# Altium project RSX_High_Power_Board.PrjPcb (part 1 of 2)
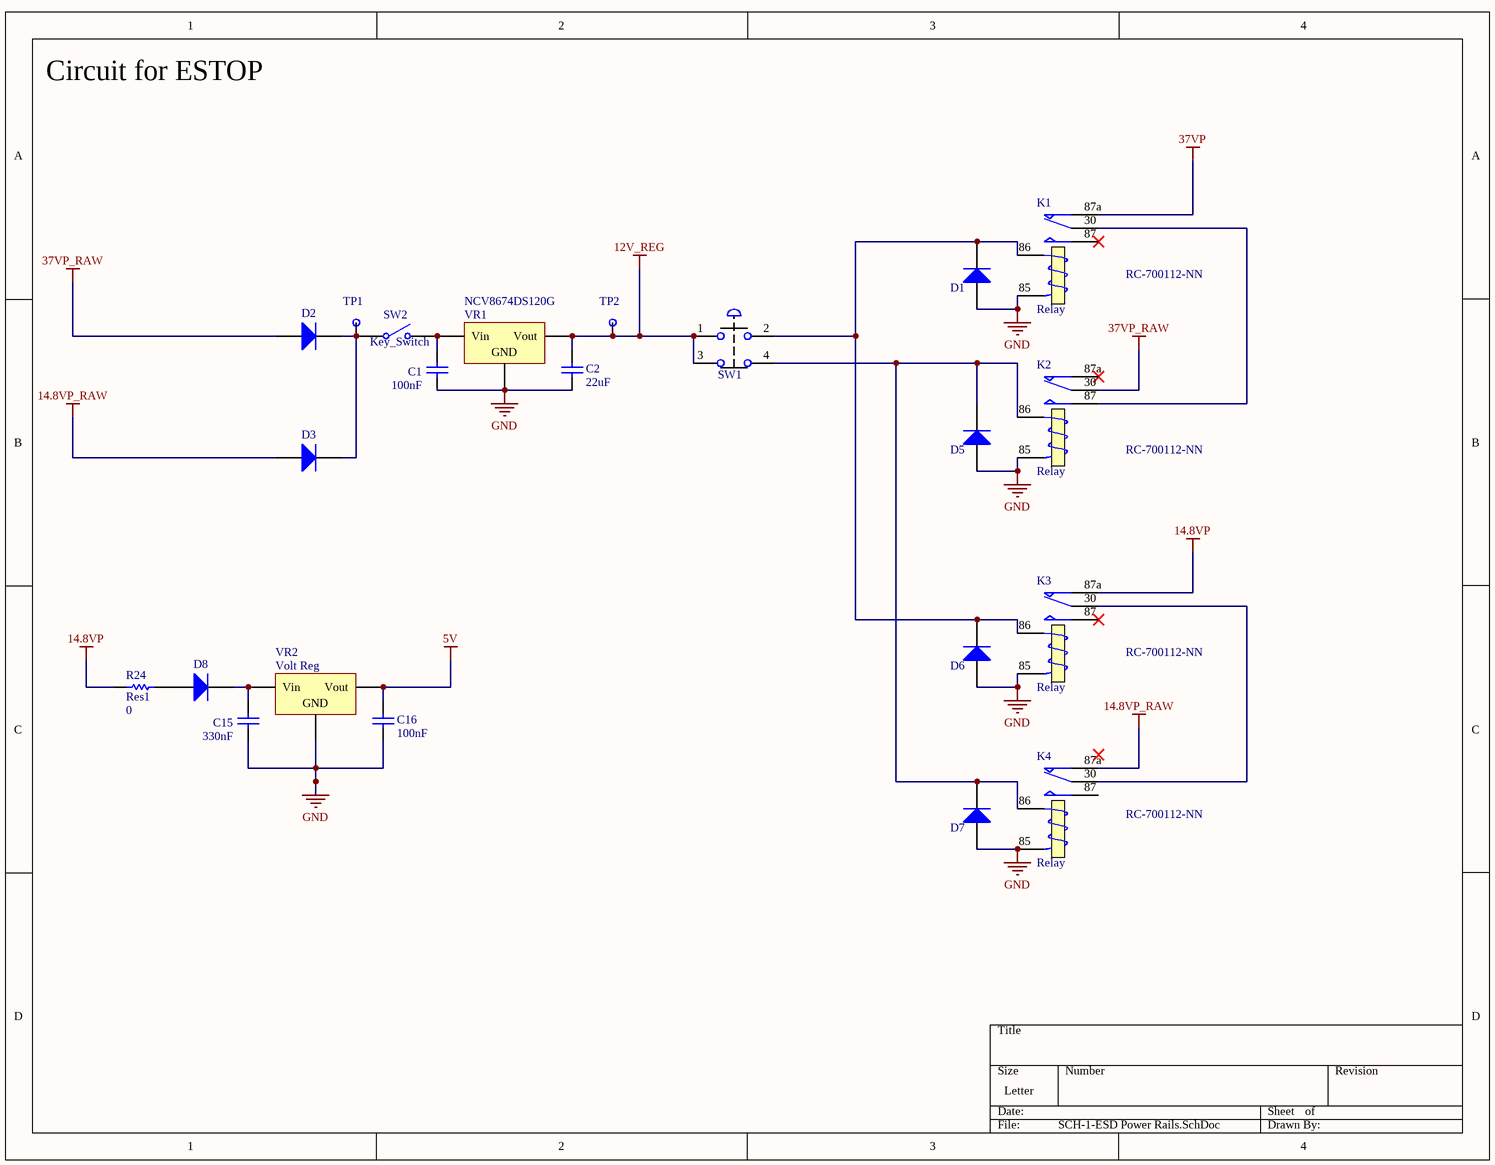
[diagram p0: SCH-1-ESD Power Rails.SchDoc]
11 sheets, 231 parts. Net scope: flat (ports and power ports of the same name join across sheets).
Board file: Drive Board.PcbDoc
Sheets:
  SCH-1-ESD Power Rails.SchDoc
  SCH-2-Main Controls.SchDoc
  SCH-3-ESC1.SchDoc
  SCH-4-ESC2.SchDoc
  SCH-5-ESC3.SchDoc
  SCH-6-ESC4.SchDoc
  SCH-7-ESC5.SchDoc
  SCH-8-ESC6.SchDoc
  SCH-9-Battery Voltage Indicators.SchDoc
  SCH-10-Power Connectors.SchDoc
  SCH-11-Out Going Connectors.SchDoc

## Sheet SCH-1-ESD Power Rails.SchDoc
size Letter

### Parts
C1  value 100nF  [1608[0603]]  (hidden comment: Cap)
C2  value 22uF  [1608[0603]]  (hidden comment: Cap)
C15  value 330nF  [1608[0603]]  (hidden comment: Cap)
C16  value 100nF  [1608[0603]]  (hidden comment: Cap)
D1  Diode 1N4001  [DO-41]  (value not drawn)
D2  Diode 1N4001  [DO-41]  (value not drawn)
D3  Diode 1N4001  [DO-41]  (value not drawn)
D5  Diode 1N4001  [DO-41]  (value not drawn)
D6  Diode 1N4001  [DO-41]  (value not drawn)
D7  Diode 1N4001  [DO-41]  (value not drawn)
D8  Diode 1N4001  [DO-41]  (value not drawn)
K1  Relay  [Relay RC-700112-NN]
K2  Relay  [Relay RC-700112-NN]
K3  Relay  [Relay RC-700112-NN]
K4  Relay  [Relay RC-700112-NN]
R24  Res1  value 0  [AXIAL-0.3]
SW1  NO-NC ESD with light  [MOLEX 0039281043]  (value not drawn)
SW2  Key_Switch  [MOLEX_0039293026]
TP1  TestPt  [50_MIL_PAD]  (value not drawn)
TP2  TestPt  [50_MIL_PAD]  (value not drawn)
VR1  Volt Reg  [DPAK254P1420X457-3N]  (value not drawn)
VR2  Volt Reg  [D2PAK_N]

### Nets
5V: C16.1 VR2.3(Vout)
12V_REG: C2.1 SW1.1 SW1.3 TP2.1 VR1.3(Vout)
14.8VP: K3.87a(NC) R24.1
14.8VP_RAW: D3.1(A) K4.87a(NC)
37VP: K1.87a(NC)
37VP_RAW: D2.1(A) K2.30(COM)
GND: C1.2 C2.2 C15.2 C16.2 D1.1(A) D5.1(A) D6.1(A) D7.1(A) K1.85(T2) K2.85(T2) K3.85(T2) K4.85(T2) VR1.2(GND) VR2.2(GND)
NetC1_1: C1.1 SW2.2(NO) VR1.1(Vin)
NetC15_1: C15.1 D8.2(K) VR2.1(Vin)
NetD1_2: D1.2(K) D6.2(K) K1.86(T1) K3.86(T1) SW1.2
NetD2_2: D2.2(K) D3.2(K) SW2.1(COMMON) TP1.1
NetD5_2: D5.2(K) D7.2(K) K2.86(T1) K4.86(T1) SW1.4
NetD8_1: D8.1(A) R24.2
NetK1_30: K1.30(COM) K2.87(NO)
NetK3_30: K3.30(COM) K4.30(COM)

Not connected (* = marked no-connect by the designer): K1 87(NO)*; K2 87a(NC)*; K3 87(NO)*; K4 87(NO)

### Notes on the sheet
- Circuit for ESTOP
- (near VR1) NCV8674DS120G
- RC-700112-NN

### Library data of the parts
C1 C2 C15 C16 = Cap: Capacitor; Published: 8-Jun-2000; LatestRevisionDate: 17-Jul-2002; LatestRevisionNote: Re-released for DXP Platform.; PackageReference: RAD-0.3; Publisher: Altium Limited; PackageDescription: Radial Cap, Thru-Hole; 2 Leads; 0.3 in Pin Spacing
D1-D3 D5-D8 = Diode 1N4001: 1 Amp General Purpose Rectifier; Published: 8-Jun-2000; LatestRevisionDate: 17-Jul-2002; LatestRevisionNote: Re-released for DXP Platform.; DatasheetVersion: 1998; PackageVersion: Aug-1999; PackageReference: DO-41; Publisher: Altium Limited; PackageDescription: Diode, Axial; Body 5.2 x 2.7 mm (LxDia. max), Lead Dia. 0.86 mm (max); Code_JEDEC: DO-204-AL; ComponentLink1Description: Manufacturer Link; ComponentLink1URL: http://www.fairchildsemi.com/; ComponentLink2Description: Datasheet; ComponentLink2URL: http://www.fairchildsemi.com/ds/1N%2F1N4001.pdf
K1-K4 = Relay: SPDT Relay; Published: 8-Jun-2000; LatestRevisionDate: 17-Jul-2002; LatestRevisionNote: Re-released for DXP Platform.; PackageReference: MODULE5B; Publisher: Altium Limited
R24 = Res1: Resistor; Published: 8-Jun-2000; LatestRevisionDate: 17-Jul-2002; LatestRevisionNote: Re-released for DXP Platform.; PackageReference: AXIAL-0.3; Publisher: Altium Limited; PackageDescription: Axial Device, Thru-Hole; 2 Leads; 0.3 in Pin Spacing
SW1 = DPST ESTOP
VR1 VR2 = Volt Reg: Voltage Regulator; Published: 24-Mar-1999; LatestRevisionDate: 29-May-2009; LatestRevisionNote: IPC-7351 Footprint Added.; PackageReference: D2PAK; Publisher: Altium Limited; PackageDescription: 3-Pin Transistor Outline Package 2.54 mm Pitch, 15.1 mm Lead Span
SW2 = Key_Switch: Published: 24-Mar-1999; LatestRevisionDate: 17-Jul-2002; LatestRevisionNote: Re-released for DXP Platform.; PackageReference: SPST-2; Publisher: Altium Limited; PackageDescription: Switch; 2 Leads

## Sheet SCH-2-Main Controls.SchDoc
size Letter
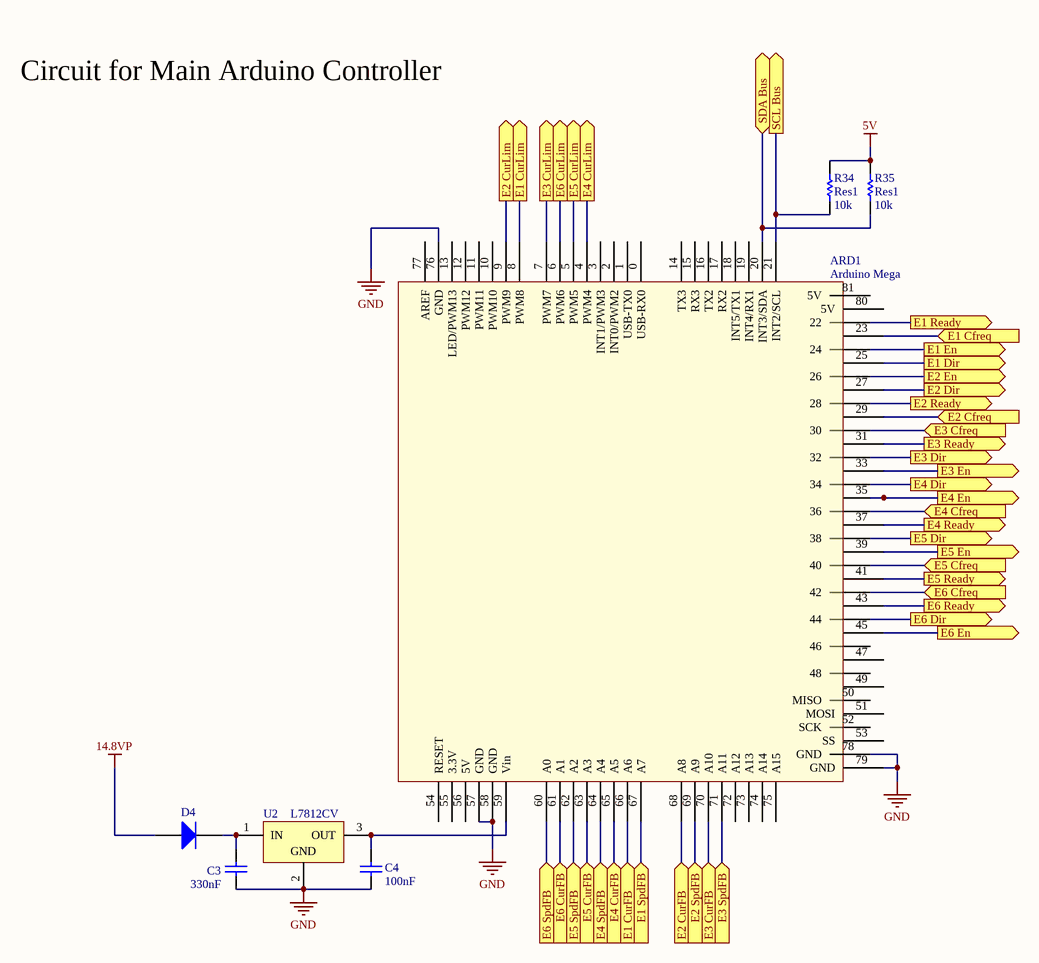
[diagram p1: SCH-2-Main Controls.SchDoc]

### Parts
ARD1  Arduino Mega  [Arduino Mega]
C3  value 330nF  [1608[0603]]  (hidden comment: Cap)
C4  value 100nF  [1608[0603]]  (hidden comment: Cap)
D4  Diode 1N4001  [DO-41]  (value not drawn)
R34  Res1  value 10k  [RESC1608X06N_0603]
R35  Res1  value 10k  [RESC1608X06N_0603]
U2  L7812CV  [TO220]

### Ports
E1 Cfreq (in), E1 CurFB (in), E1 CurLim (out), E1 Dir (out), E1 En (out), E1 Ready (out), E1 SpdFB (in), E2 Cfreq (in), E2 CurFB (in), E2 CurLim (out), E2 Dir (out), E2 En (out), E2 Ready (out), E2 SpdFB (in), E3 Cfreq (in), E3 CurFB (in), E3 CurLim (out), E3 Dir (out), E3 En (out), E3 Ready (out), E3 SpdFB (in), E4 Cfreq (in), E4 CurFB (in), E4 CurLim (out), E4 Dir (out), E4 En (out), E4 Ready (out), E4 SpdFB (in), E5 Cfreq (in), E5 CurFB (in), E5 CurLim (out), E5 Dir (out), E5 En (out), E5 Ready (out), E5 SpdFB (in), E6 Cfreq (in), E6 CurFB (in), E6 CurLim (out), E6 Dir (out), E6 En (out), E6 Ready (out), E6 SpdFB (in), SCL Bus (out), SDA Bus (bidir)

### Nets
5V: R34.2 R35.2
14.8VP: D4.1(A)
GND: ARD1.57(GND) ARD1.58(GND) ARD1.76(GND) ARD1.78(GND) ARD1.79(GND) C3.2 C4.2 U2.2(GND)
NetARD1_4: ARD1.4(PWM4) ; port E4 CurLim
NetARD1_5: ARD1.5(PWM5) ; port E5 CurLim
NetARD1_6: ARD1.6(PWM6) ; port E6 CurLim
NetARD1_7: ARD1.7(PWM7) ; port E3 CurLim
NetARD1_8: ARD1.8(PWM8) ; port E1 CurLim
NetARD1_9: ARD1.9(PWM9) ; port E2 CurLim
NetARD1_20: ARD1.20(INT3/SDA) R35.1 ; port SDA Bus
NetARD1_21: ARD1.21(INT2/SCL) R34.1 ; port SCL Bus
NetARD1_22: ARD1.22 ; port E1 Ready
NetARD1_23: ARD1.23 ; port E1 Cfreq
NetARD1_24: ARD1.24 ; port E1 En
NetARD1_25: ARD1.25 ; port E1 Dir
NetARD1_26: ARD1.26 ; port E2 En
NetARD1_27: ARD1.27 ; port E2 Dir
NetARD1_28: ARD1.28 ; port E2 Ready
NetARD1_29: ARD1.29 ; port E2 Cfreq
NetARD1_30: ARD1.30 ; port E3 Cfreq
NetARD1_31: ARD1.31 ; port E3 Ready
NetARD1_32: ARD1.32 ; port E3 Dir
NetARD1_33: ARD1.33 ; port E3 En
NetARD1_34: ARD1.34 ; port E4 Dir
NetARD1_35: ARD1.35 ; port E4 En
NetARD1_36: ARD1.36 ; port E4 Cfreq
NetARD1_37: ARD1.37 ; port E4 Ready
NetARD1_38: ARD1.38 ; port E5 Dir
NetARD1_39: ARD1.39 ; port E5 En
NetARD1_40: ARD1.40 ; port E5 Cfreq
NetARD1_41: ARD1.41 ; port E5 Ready
NetARD1_42: ARD1.42 ; port E6 Cfreq
NetARD1_43: ARD1.43 ; port E6 Ready
NetARD1_44: ARD1.44 ; port E6 Dir
NetARD1_45: ARD1.45 ; port E6 En
NetARD1_59: ARD1.59(Vin) C4.1 U2.3(OUT)
NetARD1_60: ARD1.60(A0) ; port E6 SpdFB
NetARD1_61: ARD1.61(A1) ; port E6 CurFB
NetARD1_62: ARD1.62(A2) ; port E5 SpdFB
NetARD1_63: ARD1.63(A3) ; port E5 CurFB
NetARD1_64: ARD1.64(A4) ; port E4 SpdFB
NetARD1_65: ARD1.65(A5) ; port E4 CurFB
NetARD1_66: ARD1.66(A6) ; port E1 CurFB
NetARD1_67: ARD1.67(A7) ; port E1 SpdFB
NetARD1_68: ARD1.68(A8) ; port E2 CurFB
NetARD1_69: ARD1.69(A9) ; port E2 SpdFB
NetARD1_70: ARD1.70(A10) ; port E3 CurFB
NetARD1_71: ARD1.71(A11) ; port E3 SpdFB
NetC3_1: C3.1 D4.2(K) U2.1(IN)

Not connected (* = marked no-connect by the designer): ARD1 0(USB-RX0) 1(USB-TX0) 2(INT0/PWM2) 3(INT1/PWM3) 10(PWM10) 11(PWM11) 12(PWM12) 13(LED/PWM13) 14(TX3) 15(RX3) 16(TX2) 17(RX2) 18(INT5/TX1) 19(INT4/RX1) 46 47 48 49 50(MISO) 51(MOSI) 52(SCK) 53(SS) 54(RESET) 55(3.3V) 56(5V) 72(A12) 73(A13) 74(A14) 75(A15) 77(AREF) 80(5V) 81(5V)

### Notes on the sheet
- Circuit for Main Arduino Controller

### Library data of the parts
C3 C4 = Cap: Capacitor; Published: 8-Jun-2000; LatestRevisionDate: 17-Jul-2002; LatestRevisionNote: Re-released for DXP Platform.; PackageReference: RAD-0.3; Publisher: Altium Limited; PackageDescription: Radial Cap, Thru-Hole; 2 Leads; 0.3 in Pin Spacing
D4 = Diode 1N4001: 1 Amp General Purpose Rectifier; Published: 8-Jun-2000; LatestRevisionDate: 17-Jul-2002; LatestRevisionNote: Re-released for DXP Platform.; DatasheetVersion: 1998; PackageVersion: Aug-1999; PackageReference: DO-41; Publisher: Altium Limited; PackageDescription: Diode, Axial; Body 5.2 x 2.7 mm (LxDia. max), Lead Dia. 0.86 mm (max); Code_JEDEC: DO-204-AL; ComponentLink1Description: Manufacturer Link; ComponentLink1URL: http://www.fairchildsemi.com/; ComponentLink2Description: Datasheet; ComponentLink2URL: http://www.fairchildsemi.com/ds/1N%2F1N4001.pdf
R34 R35 = Res1: Resistor; Published: 8-Jun-2000; LatestRevisionDate: 17-Jul-2002; LatestRevisionNote: Re-released for DXP Platform.; PackageReference: AXIAL-0.3; Publisher: Altium Limited; PackageDescription: Axial Device, Thru-Hole; 2 Leads; 0.3 in Pin Spacing
U2 = CMP-0244-00450-1: Positive Voltage Regulator, 12V, 3-Pin TO-220; PackageDescription: TO, Thru-Hole, Vertical, Heatsink Mounted; 3 In-Line Leads; Pitch 2.54 mm; ComponentLink3URL: http://www.st.com/internet/com/TECHNICAL_RESOURCES/TECHNICAL_LITERATURE/PACKAGE_INFORMATION/CD00004649.pdf; ComponentLink1URL: http://www.st.com; ComponentLink2Description: Datasheet; ComponentLink3Description: Package Specification; ComponentLink2URL: http://www.st.com/internet/com/TECHNICAL_RESOURCES/TECHNICAL_LITERATURE/DATASHEET/CD00000444.pdf; DatasheetVersion: 16/11/2011; PackageVersion: ver3.0; PackageReference: TO220; ComponentLink1Description: Manufacturer URL

## Sheet SCH-3-ESC1.SchDoc
size Letter; SheetNumber: 2
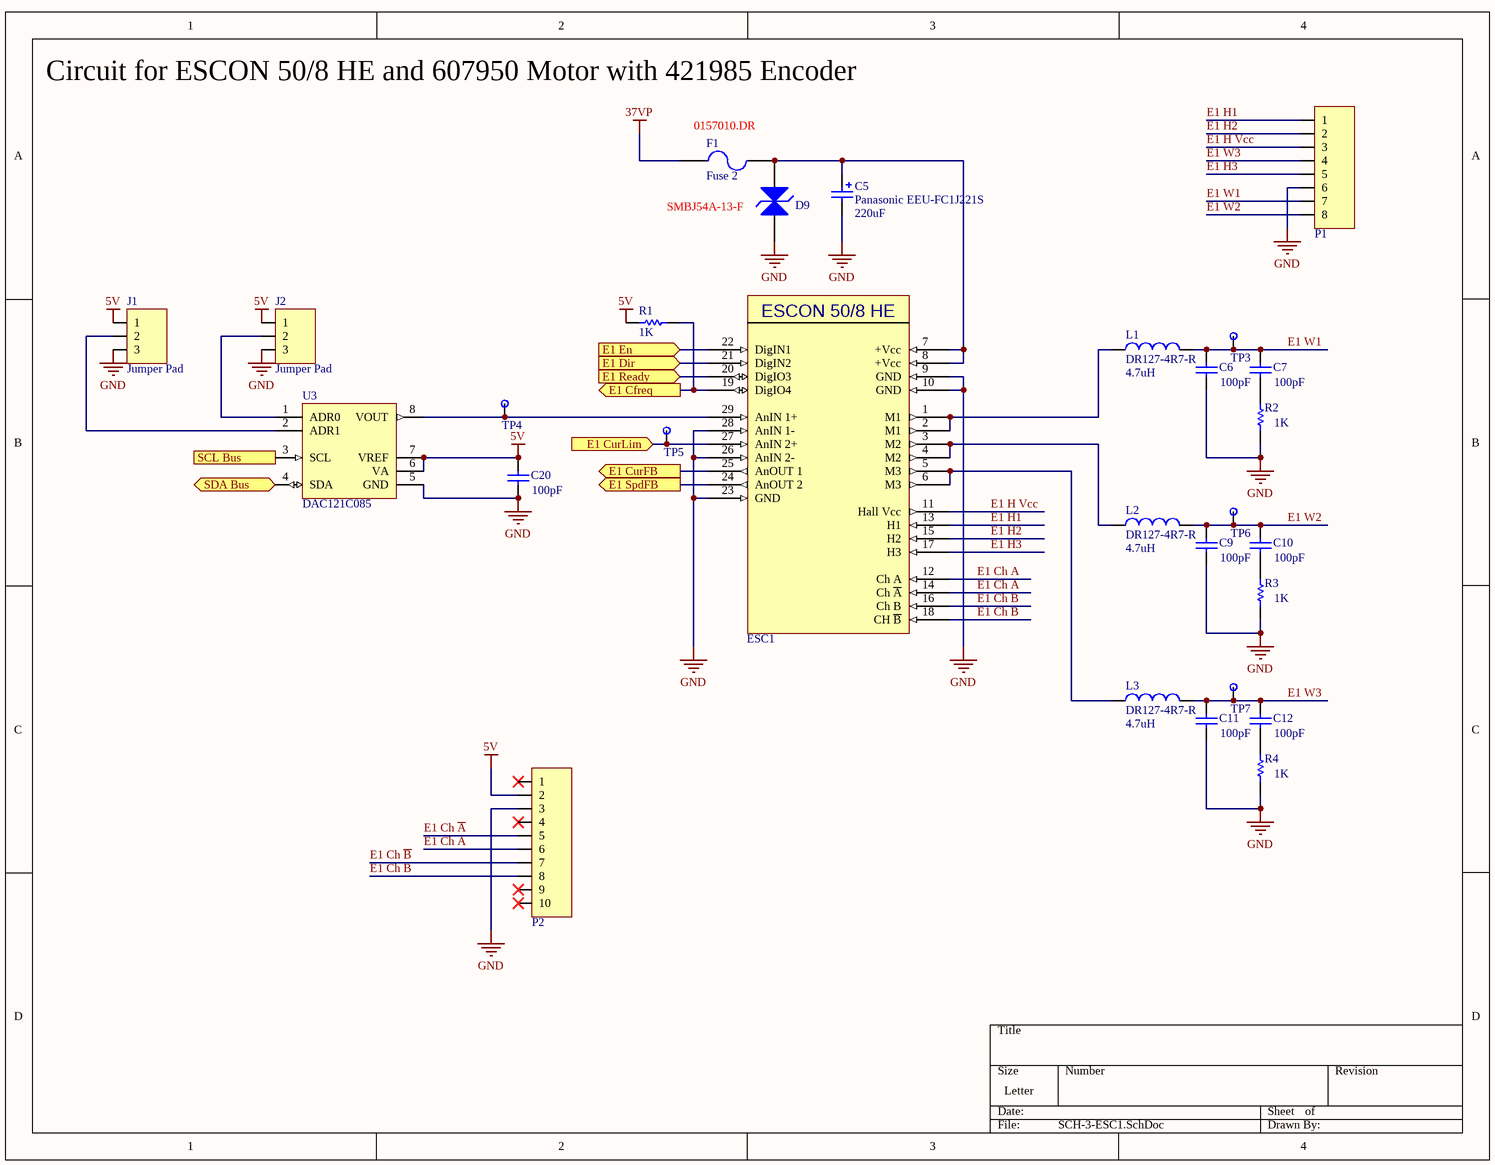
[diagram p2: SCH-3-ESC1.SchDoc]

### Parts
C5  Panasonic EEU-FC1J221S  value 220uF  [Panasonic EEU-FC1J221S]
C6  value 100pF  [C1206]  (hidden comment: Cap Semi)
C7  value 100pF  [C1206]  (hidden comment: Cap Semi)
C9  value 100pF  [C1206]  (hidden comment: Cap Semi)
C10  value 100pF  [C1206]  (hidden comment: Cap Semi)
C11  value 100pF  [C1206]  (hidden comment: Cap Semi)
C12  value 100pF  [C1206]  (hidden comment: Cap Semi)
C20  value 100pF  [C1206]  (hidden comment: Cap Semi)
D9  TVS_DIODE  [SMBJ54A-13-F]  (value not drawn)
ESC1  ESCON 50/8 HE  [ESCON 50/8 HE]  (value not drawn)
F1  Fuse 2  [0157010.DR]
J1  Jumper Pad  [3 Pad TH]
J2  Jumper Pad  [3 Pad TH]
L1  DR127-4R7-R  value 4.7uH  [DR127-4R7-R]
L2  DR127-4R7-R  value 4.7uH  [DR127-4R7-R]
L3  DR127-4R7-R  value 4.7uH  [DR127-4R7-R]
P1  Mini-Fit Jr 8 Pos  [Molex Mini-Fit Jr 0039281083]  (value not drawn)
P2  Header_10_Pos_Ribbon Male  [3M_2510-6002UB]  (value not drawn)
R1  value 1K  [RESC1608X06N_0603]  (hidden comment: Res1)
R2  value 1K  [RESC1608X06N_0603]  (hidden comment: Res1)
R3  value 1K  [RESC1608X06N_0603]  (hidden comment: Res1)
R4  value 1K  [RESC1608X06N_0603]  (hidden comment: Res1)
TP3  TestPt  [50_MIL_PAD]  (value not drawn)
TP4  TestPt  [50_MIL_PAD]  (value not drawn)
TP5  TestPt  [50_MIL_PAD]  (value not drawn)
TP6  TestPt  [50_MIL_PAD]  (value not drawn)
TP7  TestPt  [50_MIL_PAD]  (value not drawn)
U3  DAC121C085  [MUA08A_L]

### Ports
E1 Cfreq (out), E1 CurFB (out), E1 CurLim (in), E1 Dir (in), E1 En (in), E1 Ready (in), E1 SpdFB (out), SCL Bus (in), SDA Bus (bidir)

### Nets
5V: C20.2 J1.1 J2.1 P2.2 R1.2 U3.6(VA) U3.7(VREF)
37VP: F1.1
GND: C5.2 C6.1 C9.1 C11.1 C20.1 D9.1(A) ESC1.9(GND) ESC1.10(GND) ESC1.23(GND) ESC1.26(AnIN_2-) ESC1.28(AnIN_1-) J1.3 J2.3 P1.6 P2.3 R2.1 R3.1 R4.1 U3.5(GND)
E1 Ch A: ESC1.12(Ch_A) P2.6
E1 Ch ~{A}: ESC1.14(Ch_~{A}) P2.5
E1 Ch B: ESC1.16(Ch_B) P2.8
E1 Ch ~{B}: ESC1.18(CH_~{B}) P2.7
E1 H1: ESC1.13(H1) P1.1
E1 H2: ESC1.15(H2) P1.2
E1 H3: ESC1.17(H3) P1.5
E1 H Vcc: ESC1.11(Hall_Vcc) P1.3
E1 W1: C6.2 C7.2 L1.2 P1.7 TP3.1
E1 W2: C9.2 C10.2 L2.2 P1.8 TP6.1
E1 W3: C11.2 C12.2 L3.2 P1.4 TP7.1
NetARD1_8: ESC1.27(AnIN_2+) TP5.1 ; port E1 CurLim
NetARD1_20: U3.4(SDA) ; port SDA Bus
NetARD1_21: U3.3(SCL) ; port SCL Bus
NetARD1_22: ESC1.20(DigIO3) ; port E1 Ready
NetARD1_23: ESC1.19(DigIO4) R1.1 ; port E1 Cfreq
NetARD1_24: ESC1.22(DigIN1) ; port E1 En
NetARD1_25: ESC1.21(DigIN2) ; port E1 Dir
NetARD1_66: ESC1.25(AnOUT_1) ; port E1 CurFB
NetARD1_67: ESC1.24(AnOUT_2) ; port E1 SpdFB
NetC5_1: C5.1 D9.2(K) ESC1.7(+Vcc) ESC1.8(+Vcc) F1.2
NetC7_1: C7.1 R2.2
NetC10_1: C10.1 R3.2
NetC12_1: C12.1 R4.2
NetESC1_1: ESC1.1(M1) ESC1.2(M1) L1.1
NetESC1_3: ESC1.3(M2) ESC1.4(M2) L2.1
NetESC1_5: ESC1.5(M3) ESC1.6(M3) L3.1
NetESC1_29: ESC1.29(AnIN_1+) TP4.1 U3.8(VOUT)
NetJ1_2: J1.2 U3.2(ADR1)
NetJ2_2: J2.2 U3.1(ADR0)

Not connected (* = marked no-connect by the designer): P2 1* 4* 9* 10*

### Notes on the sheet
- Circuit for ESCON 50/8 HE and 607950 Motor with 421985 Encoder
- (near F1) 0157010.DR
- SMBJ54A-13-F

### Library data of the parts
C5 = Panasonic EEU-FC1J221S: Polarized Capacitor (Radial)
C6 C7 C9-C12 C20 = Cap Semi: Capacitor (Semiconductor SIM Model); Published: 8-Jun-2000; LatestRevisionDate: 29-May-2009; LatestRevisionNote: IPC-7351 Footprint Added.; PackageReference: C1206; Publisher: Altium Limited; PackageDescription: Chip Capacitor
D9 = TVS_DIODE: TVS Diode; Published: 8-Jun-2000; LatestRevisionDate: 17-Jul-2002; LatestRevisionNote: Re-released for DXP Platform.; PackageVersion: Sep-1996; PackageReference: SMC; Publisher: Altium Limited; PackageDescription: DO-214-AB/SMC; 2 C-Bend Leads; Body 7.9 x 5.9 mm, inc. leads (LxW); Code_JEDEC: DO-214-AB
ESC1 = ESCON 50/8 HE: ESCON Module 50/8 HE Servocontroller
F1 = Fuse 2: Fuse; Published: 8-Jun-2000; LatestRevisionDate: 17-Jul-2002; LatestRevisionNote: Re-released for DXP Platform.; PackageReference: PIN-W2/E2.8; Publisher: Altium Limited; PackageDescription: Thru-Hole; 2 Leads
J1 J2 = 3 Pad Jump Sel
L1-L3 = DR127-4R7-R: 4.7µH Shielded Wirewound Inductor 8.25A 9.17mOhm Nonstandard; Code_IEC: 1005; Published: 8-Jun-2000; LatestRevisionDate: 29-May-2009; LatestRevisionNote: IPC-7351 Footprint Added.; PackageReference: 0402-A; Publisher: Altium Limited; PackageDescription: Chip Inductor; Code_JEITA: 0402
P1 = Molex Mini-Fit Jr 8pos Vert
P2 = Header_10_Pos_Ribbon Male: 3M_2510-6002UB
R1-R4 = Res1: Resistor; Published: 8-Jun-2000; LatestRevisionDate: 17-Jul-2002; LatestRevisionNote: Re-released for DXP Platform.; PackageReference: AXIAL-0.3; Publisher: Altium Limited; PackageDescription: Axial Device, Thru-Hole; 2 Leads; 0.3 in Pin Spacing
U3 = DAC121C085: 12-Bit Micro Power Digital-to-Analog Converter with an I2C-Compatible Interface and External Reference, 8-pin Mini SOIC, Pb-Free; Manufacturer: National Semiconductor; PackageTopMarking: XTT*X90C; PowerWise: Y; CompType: D/A Converter; ComponentLink3URL: http://www.national.com/packaging/folders/mua08a.html; ComponentLink2URL: http://www.national.com/pf/DA/DAC121C085.html; Code_JEDEC: MO-187-AA; ComponentLink1URL: http://www.national.com/ds/DA/DAC121C085.pdf; RoHS: Y; PackageVersion: revF, Apr-2008; PackageDescription: MINI SOIC, .118 x .118 x .034in, 8 Lead, .0256in Pitch; PackageReference: MUA08A; PinCount: 8; DatasheetVersion: Mar-2008; ComponentLink1Description: DAC121C085 Datasheet; ComponentLink2Description: DAC121C085 Web Page; ComponentLink3Description: MUA08A Package Page; RevisionNote: Component URLs added

## Sheet SCH-4-ESC2.SchDoc
size Letter; SheetNumber: 2
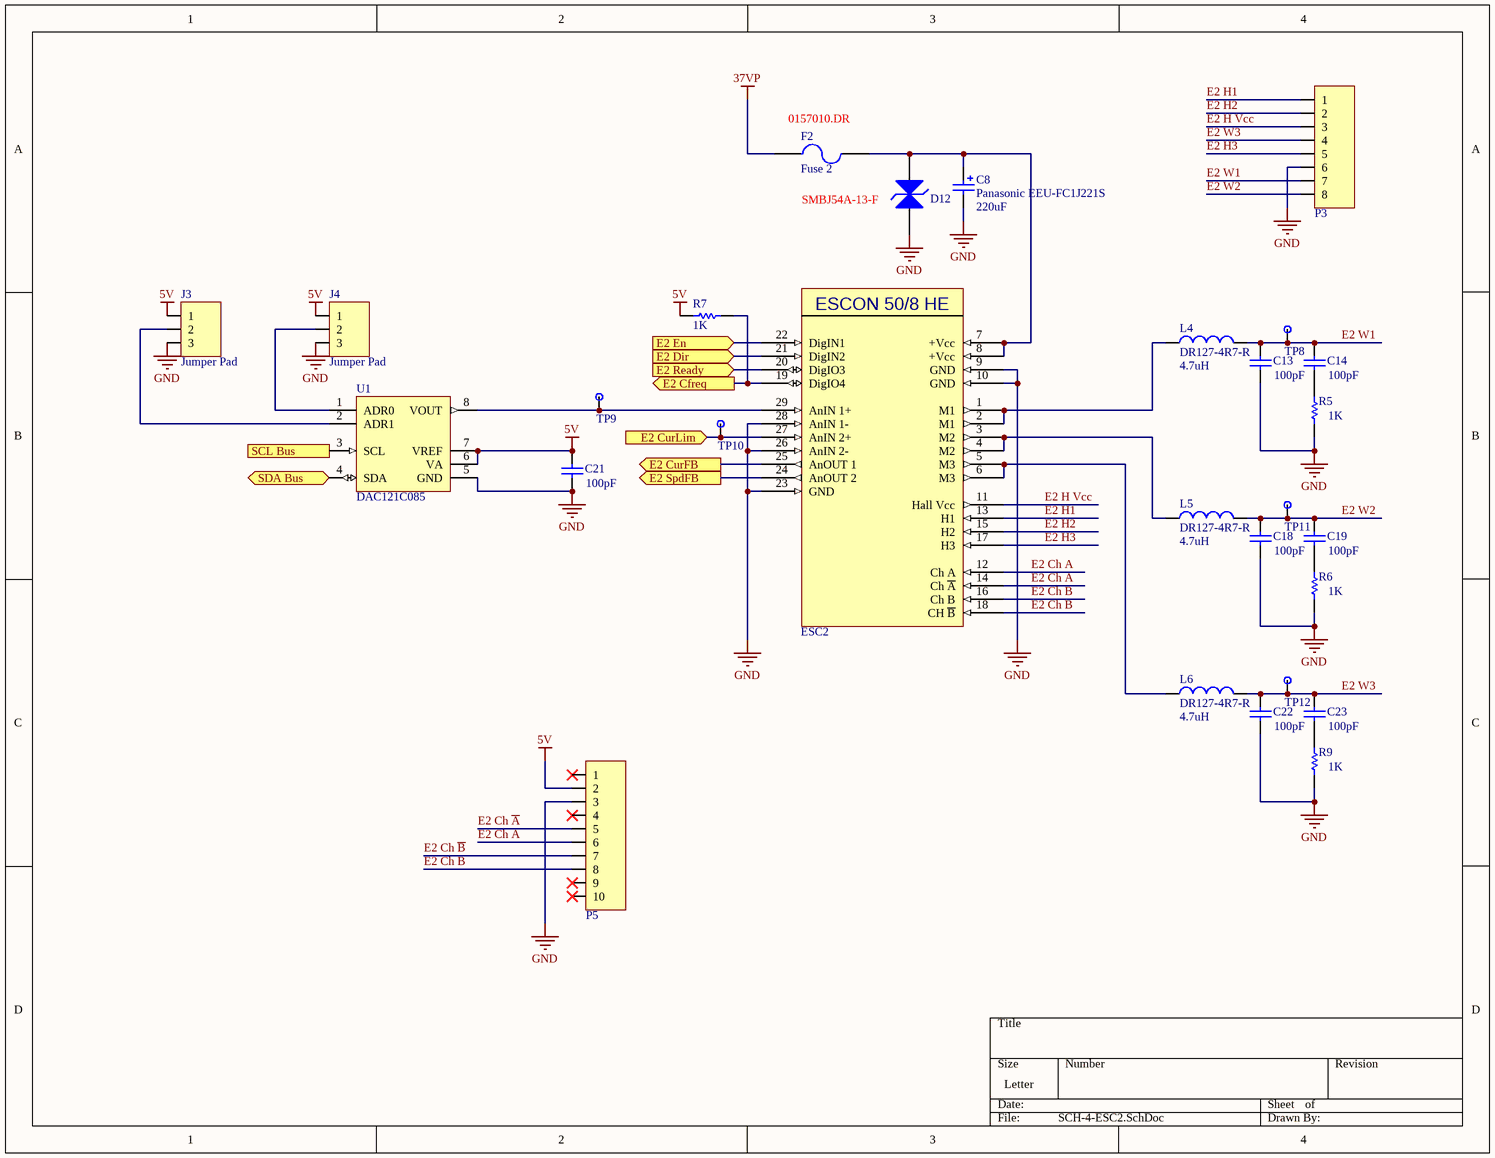
[diagram p3: SCH-4-ESC2.SchDoc]

### Parts
C8  Panasonic EEU-FC1J221S  value 220uF  [Panasonic EEU-FC1J221S]
C13  value 100pF  [C1206]  (hidden comment: Cap Semi)
C14  value 100pF  [C1206]  (hidden comment: Cap Semi)
C18  value 100pF  [C1206]  (hidden comment: Cap Semi)
C19  value 100pF  [C1206]  (hidden comment: Cap Semi)
C21  value 100pF  [C1206]  (hidden comment: Cap Semi)
C22  value 100pF  [C1206]  (hidden comment: Cap Semi)
C23  value 100pF  [C1206]  (hidden comment: Cap Semi)
D12  TVS_DIODE  [SMBJ54A-13-F]  (value not drawn)
ESC2  ESCON 50/8 HE  [ESCON 50/8 HE]  (value not drawn)
F2  Fuse 2  [0157010.DR]
J3  Jumper Pad  [3 Pad TH]
J4  Jumper Pad  [3 Pad TH]
L4  DR127-4R7-R  value 4.7uH  [DR127-4R7-R]
L5  DR127-4R7-R  value 4.7uH  [DR127-4R7-R]
L6  DR127-4R7-R  value 4.7uH  [DR127-4R7-R]
P3  Mini-Fit Jr 8 Pos  [Molex Mini-Fit Jr 0039281083]  (value not drawn)
P5  Header_10_Pos_Ribbon Male  [3M_2510-6002UB]  (value not drawn)
R5  value 1K  [RESC1608X06N_0603]  (hidden comment: Res1)
R6  value 1K  [RESC1608X06N_0603]  (hidden comment: Res1)
R7  value 1K  [RESC1608X06N_0603]  (hidden comment: Res1)
R9  value 1K  [RESC1608X06N_0603]  (hidden comment: Res1)
TP8  TestPt  [50_MIL_PAD]  (value not drawn)
TP9  TestPt  [50_MIL_PAD]  (value not drawn)
TP10  TestPt  [50_MIL_PAD]  (value not drawn)
TP11  TestPt  [50_MIL_PAD]  (value not drawn)
TP12  TestPt  [50_MIL_PAD]  (value not drawn)
U1  DAC121C085  [MUA08A_L]

### Ports
E2 Cfreq (out), E2 CurFB (out), E2 CurLim (in), E2 Dir (in), E2 En (in), E2 Ready (in), E2 SpdFB (out), SCL Bus (in), SDA Bus (bidir)

### Nets
5V: C21.2 J3.1 J4.1 P5.2 R7.2 U1.6(VA) U1.7(VREF)
37VP: F2.1
GND: C8.2 C13.1 C18.1 C21.1 C22.1 D12.1(A) ESC2.9(GND) ESC2.10(GND) ESC2.23(GND) ESC2.26(AnIN_2-) ESC2.28(AnIN_1-) J3.3 J4.3 P3.6 P5.3 R5.1 R6.1 R9.1 U1.5(GND)
E2 Ch A: ESC2.12(Ch_A) P5.6
E2 Ch ~{A}: ESC2.14(Ch_~{A}) P5.5
E2 Ch B: ESC2.16(Ch_B) P5.8
E2 Ch ~{B}: ESC2.18(CH_~{B}) P5.7
E2 H1: ESC2.13(H1) P3.1
E2 H2: ESC2.15(H2) P3.2
E2 H3: ESC2.17(H3) P3.5
E2 H Vcc: ESC2.11(Hall_Vcc) P3.3
E2 W1: C13.2 C14.2 L4.2 P3.7 TP8.1
E2 W2: C18.2 C19.2 L5.2 P3.8 TP11.1
E2 W3: C22.2 C23.2 L6.2 P3.4 TP12.1
NetARD1_9: ESC2.27(AnIN_2+) TP10.1 ; port E2 CurLim
NetARD1_20: U1.4(SDA) ; port SDA Bus
NetARD1_21: U1.3(SCL) ; port SCL Bus
NetARD1_26: ESC2.22(DigIN1) ; port E2 En
NetARD1_27: ESC2.21(DigIN2) ; port E2 Dir
NetARD1_28: ESC2.20(DigIO3) ; port E2 Ready
NetARD1_29: ESC2.19(DigIO4) R7.1 ; port E2 Cfreq
NetARD1_68: ESC2.25(AnOUT_1) ; port E2 CurFB
NetARD1_69: ESC2.24(AnOUT_2) ; port E2 SpdFB
NetC8_1: C8.1 D12.2(K) ESC2.7(+Vcc) ESC2.8(+Vcc) F2.2
NetC14_1: C14.1 R5.2
NetC19_1: C19.1 R6.2
NetC23_1: C23.1 R9.2
NetESC2_1: ESC2.1(M1) ESC2.2(M1) L4.1
NetESC2_3: ESC2.3(M2) ESC2.4(M2) L5.1
NetESC2_5: ESC2.5(M3) ESC2.6(M3) L6.1
NetESC2_29: ESC2.29(AnIN_1+) TP9.1 U1.8(VOUT)
NetJ3_2: J3.2 U1.2(ADR1)
NetJ4_2: J4.2 U1.1(ADR0)

Not connected (* = marked no-connect by the designer): P5 1* 4* 9* 10*

### Notes on the sheet
- (near F2) 0157010.DR
- SMBJ54A-13-F

### Library data of the parts
C8 = Panasonic EEU-FC1J221S: Polarized Capacitor (Radial)
C13 C14 C18 C19 C21-C23 = Cap Semi: Capacitor (Semiconductor SIM Model); Published: 8-Jun-2000; LatestRevisionDate: 29-May-2009; LatestRevisionNote: IPC-7351 Footprint Added.; PackageReference: C1206; Publisher: Altium Limited; PackageDescription: Chip Capacitor
D12 = TVS_DIODE: TVS Diode; Published: 8-Jun-2000; LatestRevisionDate: 17-Jul-2002; LatestRevisionNote: Re-released for DXP Platform.; PackageVersion: Sep-1996; PackageReference: SMC; Publisher: Altium Limited; PackageDescription: DO-214-AB/SMC; 2 C-Bend Leads; Body 7.9 x 5.9 mm, inc. leads (LxW); Code_JEDEC: DO-214-AB
ESC2 = ESCON 50/8 HE: ESCON Module 50/8 HE Servocontroller
F2 = Fuse 2: Fuse; Published: 8-Jun-2000; LatestRevisionDate: 17-Jul-2002; LatestRevisionNote: Re-released for DXP Platform.; PackageReference: PIN-W2/E2.8; Publisher: Altium Limited; PackageDescription: Thru-Hole; 2 Leads
J3 J4 = 3 Pad Jump Sel
L4-L6 = DR127-4R7-R: as L1 on sheet SCH-3-ESC1; Published: 8-Jun-2000; LatestRevisionDate: 29-May-2009; LatestRevisionNote: IPC-7351 Footprint Added.; PackageReference: 0402-A; Publisher: Altium Limited; PackageDescription: Chip Inductor; Code_JEITA: 0402
P3 = Molex Mini-Fit Jr 8pos Vert
P5 = Header_10_Pos_Ribbon Male: 3M_2510-6002UB
R5-R7 R9 = Res1: Resistor; Published: 8-Jun-2000; LatestRevisionDate: 17-Jul-2002; LatestRevisionNote: Re-released for DXP Platform.; PackageReference: AXIAL-0.3; Publisher: Altium Limited; PackageDescription: Axial Device, Thru-Hole; 2 Leads; 0.3 in Pin Spacing
U1 = DAC121C085: as U3 on sheet SCH-3-ESC1; ComponentLink3URL: http://www.national.com/packaging/folders/mua08a.html; ComponentLink2URL: http://www.national.com/pf/DA/DAC121C085.html; Code_JEDEC: MO-187-AA; ComponentLink1URL: http://www.national.com/ds/DA/DAC121C085.pdf; RoHS: Y; PackageVersion: revF, Apr-2008; PackageDescription: MINI SOIC, .118 x .118 x .034in, 8 Lead, .0256in Pitch; PackageReference: MUA08A; PinCount: 8; DatasheetVersion: Mar-2008; ComponentLink1Description: DAC121C085 Datasheet; ComponentLink2Description: DAC121C085 Web Page; ComponentLink3Description: MUA08A Package Page; RevisionNote: Component URLs added

## Sheet SCH-5-ESC3.SchDoc
size Letter
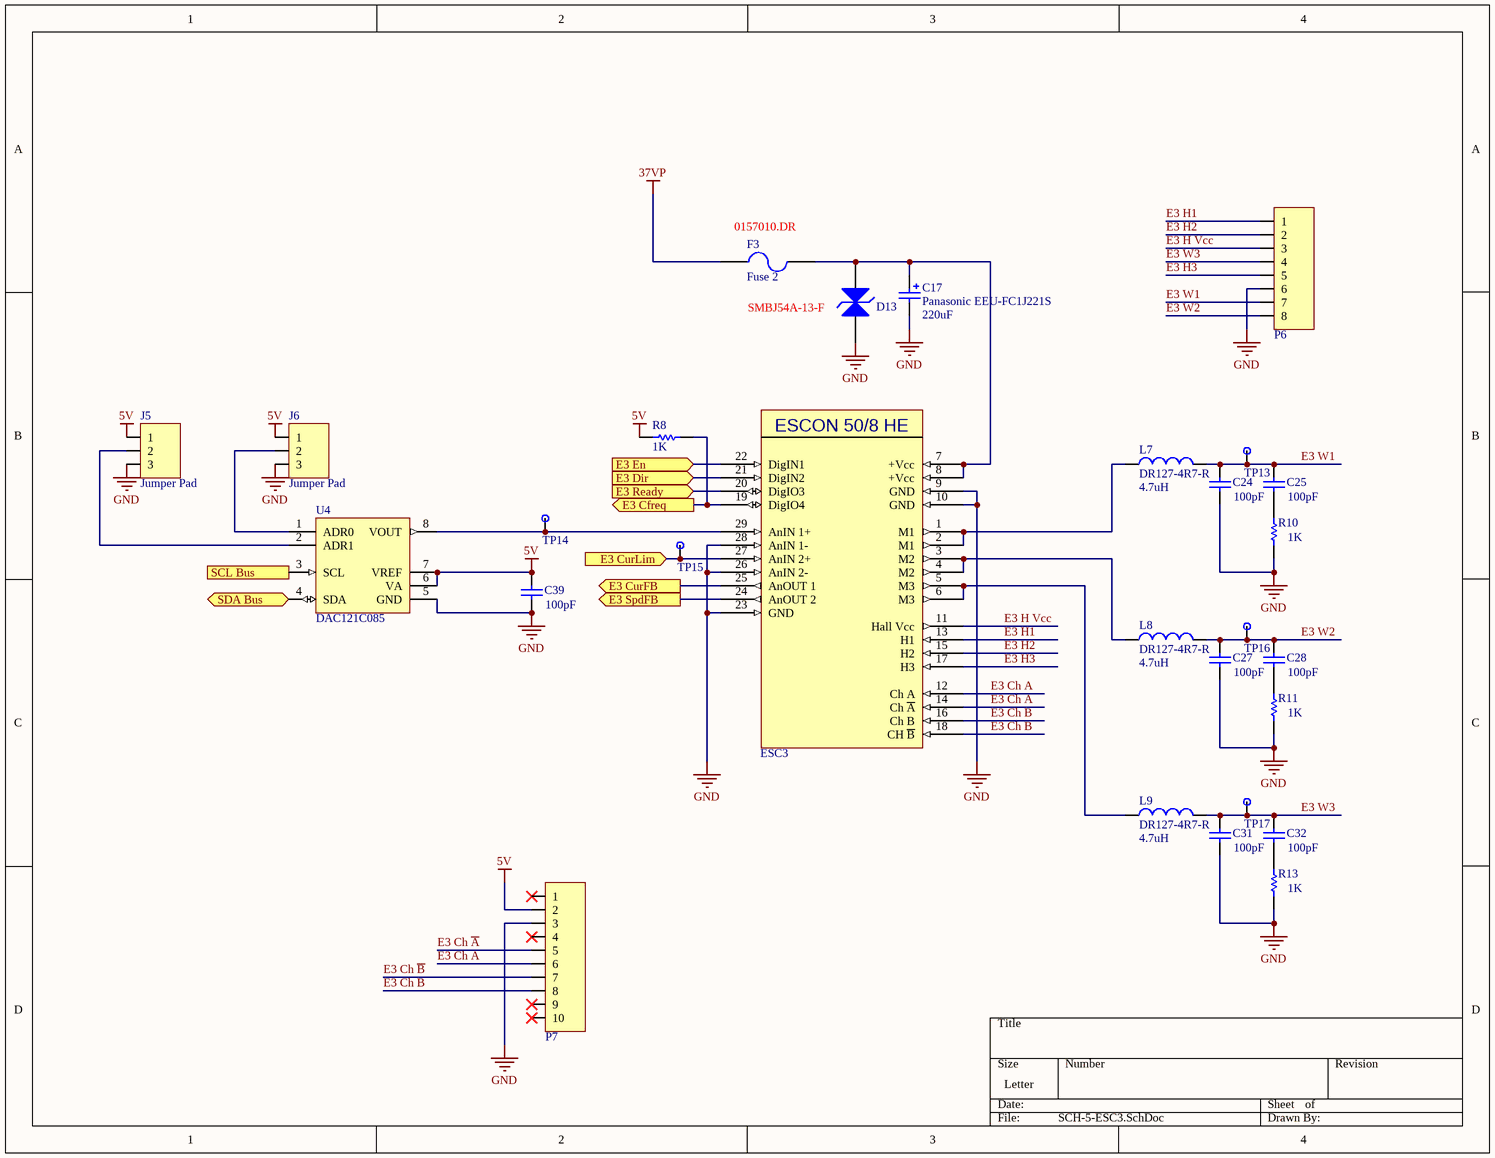
[diagram p4: SCH-5-ESC3.SchDoc]

### Parts
C17  Panasonic EEU-FC1J221S  value 220uF  [Panasonic EEU-FC1J221S]
C24  value 100pF  [C1206]  (hidden comment: Cap Semi)
C25  value 100pF  [C1206]  (hidden comment: Cap Semi)
C27  value 100pF  [C1206]  (hidden comment: Cap Semi)
C28  value 100pF  [C1206]  (hidden comment: Cap Semi)
C31  value 100pF  [C1206]  (hidden comment: Cap Semi)
C32  value 100pF  [C1206]  (hidden comment: Cap Semi)
C39  value 100pF  [C1206]  (hidden comment: Cap Semi)
D13  TVS_DIODE  [SMBJ54A-13-F]  (value not drawn)
ESC3  ESCON 50/8 HE  [ESCON 50/8 HE]  (value not drawn)
F3  Fuse 2  [0157010.DR]
J5  Jumper Pad  [3 Pad TH]
J6  Jumper Pad  [3 Pad TH]
L7  DR127-4R7-R  value 4.7uH  [DR127-4R7-R]
L8  DR127-4R7-R  value 4.7uH  [DR127-4R7-R]
L9  DR127-4R7-R  value 4.7uH  [DR127-4R7-R]
P6  Mini-Fit Jr 8 Pos  [Molex Mini-Fit Jr 0039281083]  (value not drawn)
P7  Header_10_Pos_Ribbon Male  [3M_2510-6002UB]  (value not drawn)
R8  value 1K  [RESC1608X06N_0603]  (hidden comment: Res1)
R10  value 1K  [RESC1608X06N_0603]  (hidden comment: Res1)
R11  value 1K  [RESC1608X06N_0603]  (hidden comment: Res1)
R13  value 1K  [RESC1608X06N_0603]  (hidden comment: Res1)
TP13  TestPt  [50_MIL_PAD]  (value not drawn)
TP14  TestPt  [50_MIL_PAD]  (value not drawn)
TP15  TestPt  [50_MIL_PAD]  (value not drawn)
TP16  TestPt  [50_MIL_PAD]  (value not drawn)
TP17  TestPt  [50_MIL_PAD]  (value not drawn)
U4  DAC121C085  [MUA08A_L]

### Ports
E3 Cfreq (out), E3 CurFB (out), E3 CurLim (in), E3 Dir (in), E3 En (in), E3 Ready (in), E3 SpdFB (out), SCL Bus (in), SDA Bus (bidir)

### Nets
5V: C39.2 J5.1 J6.1 P7.2 R8.2 U4.6(VA) U4.7(VREF)
37VP: F3.1
GND: C17.2 C24.1 C27.1 C31.1 C39.1 D13.1(A) ESC3.9(GND) ESC3.10(GND) ESC3.23(GND) ESC3.26(AnIN_2-) ESC3.28(AnIN_1-) J5.3 J6.3 P6.6 P7.3 R10.1 R11.1 R13.1 U4.5(GND)
E3 Ch A: ESC3.12(Ch_A) P7.6
E3 Ch ~{A}: ESC3.14(Ch_~{A}) P7.5
E3 Ch B: ESC3.16(Ch_B) P7.8
E3 Ch ~{B}: ESC3.18(CH_~{B}) P7.7
E3 H1: ESC3.13(H1) P6.1
E3 H2: ESC3.15(H2) P6.2
E3 H3: ESC3.17(H3) P6.5
E3 H Vcc: ESC3.11(Hall_Vcc) P6.3
E3 W1: C24.2 C25.2 L7.2 P6.7 TP13.1
E3 W2: C27.2 C28.2 L8.2 P6.8 TP16.1
E3 W3: C31.2 C32.2 L9.2 P6.4 TP17.1
NetARD1_7: ESC3.27(AnIN_2+) TP15.1 ; port E3 CurLim
NetARD1_20: U4.4(SDA) ; port SDA Bus
NetARD1_21: U4.3(SCL) ; port SCL Bus
NetARD1_30: ESC3.19(DigIO4) R8.1 ; port E3 Cfreq
NetARD1_31: ESC3.20(DigIO3) ; port E3 Ready
NetARD1_32: ESC3.21(DigIN2) ; port E3 Dir
NetARD1_33: ESC3.22(DigIN1) ; port E3 En
NetARD1_70: ESC3.25(AnOUT_1) ; port E3 CurFB
NetARD1_71: ESC3.24(AnOUT_2) ; port E3 SpdFB
NetC17_1: C17.1 D13.2(K) ESC3.7(+Vcc) ESC3.8(+Vcc) F3.2
NetC25_1: C25.1 R10.2
NetC28_1: C28.1 R11.2
NetC32_1: C32.1 R13.2
NetESC3_1: ESC3.1(M1) ESC3.2(M1) L7.1
NetESC3_3: ESC3.3(M2) ESC3.4(M2) L8.1
NetESC3_5: ESC3.5(M3) ESC3.6(M3) L9.1
NetESC3_29: ESC3.29(AnIN_1+) TP14.1 U4.8(VOUT)
NetJ5_2: J5.2 U4.2(ADR1)
NetJ6_2: J6.2 U4.1(ADR0)

Not connected (* = marked no-connect by the designer): P7 1* 4* 9* 10*

### Notes on the sheet
- (near F3) 0157010.DR
- SMBJ54A-13-F

### Library data of the parts
C17 = Panasonic EEU-FC1J221S: Polarized Capacitor (Radial)
C24 C25 C27 C28 C31 C32 C39 = Cap Semi: Capacitor (Semiconductor SIM Model); Published: 8-Jun-2000; LatestRevisionDate: 29-May-2009; LatestRevisionNote: IPC-7351 Footprint Added.; PackageReference: C1206; Publisher: Altium Limited; PackageDescription: Chip Capacitor
D13 = TVS_DIODE: TVS Diode; Published: 8-Jun-2000; LatestRevisionDate: 17-Jul-2002; LatestRevisionNote: Re-released for DXP Platform.; PackageVersion: Sep-1996; PackageReference: SMC; Publisher: Altium Limited; PackageDescription: DO-214-AB/SMC; 2 C-Bend Leads; Body 7.9 x 5.9 mm, inc. leads (LxW); Code_JEDEC: DO-214-AB
ESC3 = ESCON 50/8 HE: ESCON Module 50/8 HE Servocontroller
F3 = Fuse 2: Fuse; Published: 8-Jun-2000; LatestRevisionDate: 17-Jul-2002; LatestRevisionNote: Re-released for DXP Platform.; PackageReference: PIN-W2/E2.8; Publisher: Altium Limited; PackageDescription: Thru-Hole; 2 Leads
J5 J6 = 3 Pad Jump Sel
L7-L9 = DR127-4R7-R: as L1 on sheet SCH-3-ESC1; Published: 8-Jun-2000; LatestRevisionDate: 29-May-2009; LatestRevisionNote: IPC-7351 Footprint Added.; PackageReference: 0402-A; Publisher: Altium Limited; PackageDescription: Chip Inductor; Code_JEITA: 0402
P6 = Molex Mini-Fit Jr 8pos Vert
P7 = Header_10_Pos_Ribbon Male: 3M_2510-6002UB
R8 R10 R11 R13 = Res1: Resistor; Published: 8-Jun-2000; LatestRevisionDate: 17-Jul-2002; LatestRevisionNote: Re-released for DXP Platform.; PackageReference: AXIAL-0.3; Publisher: Altium Limited; PackageDescription: Axial Device, Thru-Hole; 2 Leads; 0.3 in Pin Spacing
U4 = DAC121C085: as U3 on sheet SCH-3-ESC1; ComponentLink3URL: http://www.national.com/packaging/folders/mua08a.html; ComponentLink2URL: http://www.national.com/pf/DA/DAC121C085.html; Code_JEDEC: MO-187-AA; ComponentLink1URL: http://www.national.com/ds/DA/DAC121C085.pdf; RoHS: Y; PackageVersion: revF, Apr-2008; PackageDescription: MINI SOIC, .118 x .118 x .034in, 8 Lead, .0256in Pitch; PackageReference: MUA08A; PinCount: 8; DatasheetVersion: Mar-2008; ComponentLink1Description: DAC121C085 Datasheet; ComponentLink2Description: DAC121C085 Web Page; ComponentLink3Description: MUA08A Package Page; RevisionNote: Component URLs added

## Sheet SCH-6-ESC4.SchDoc
size Letter
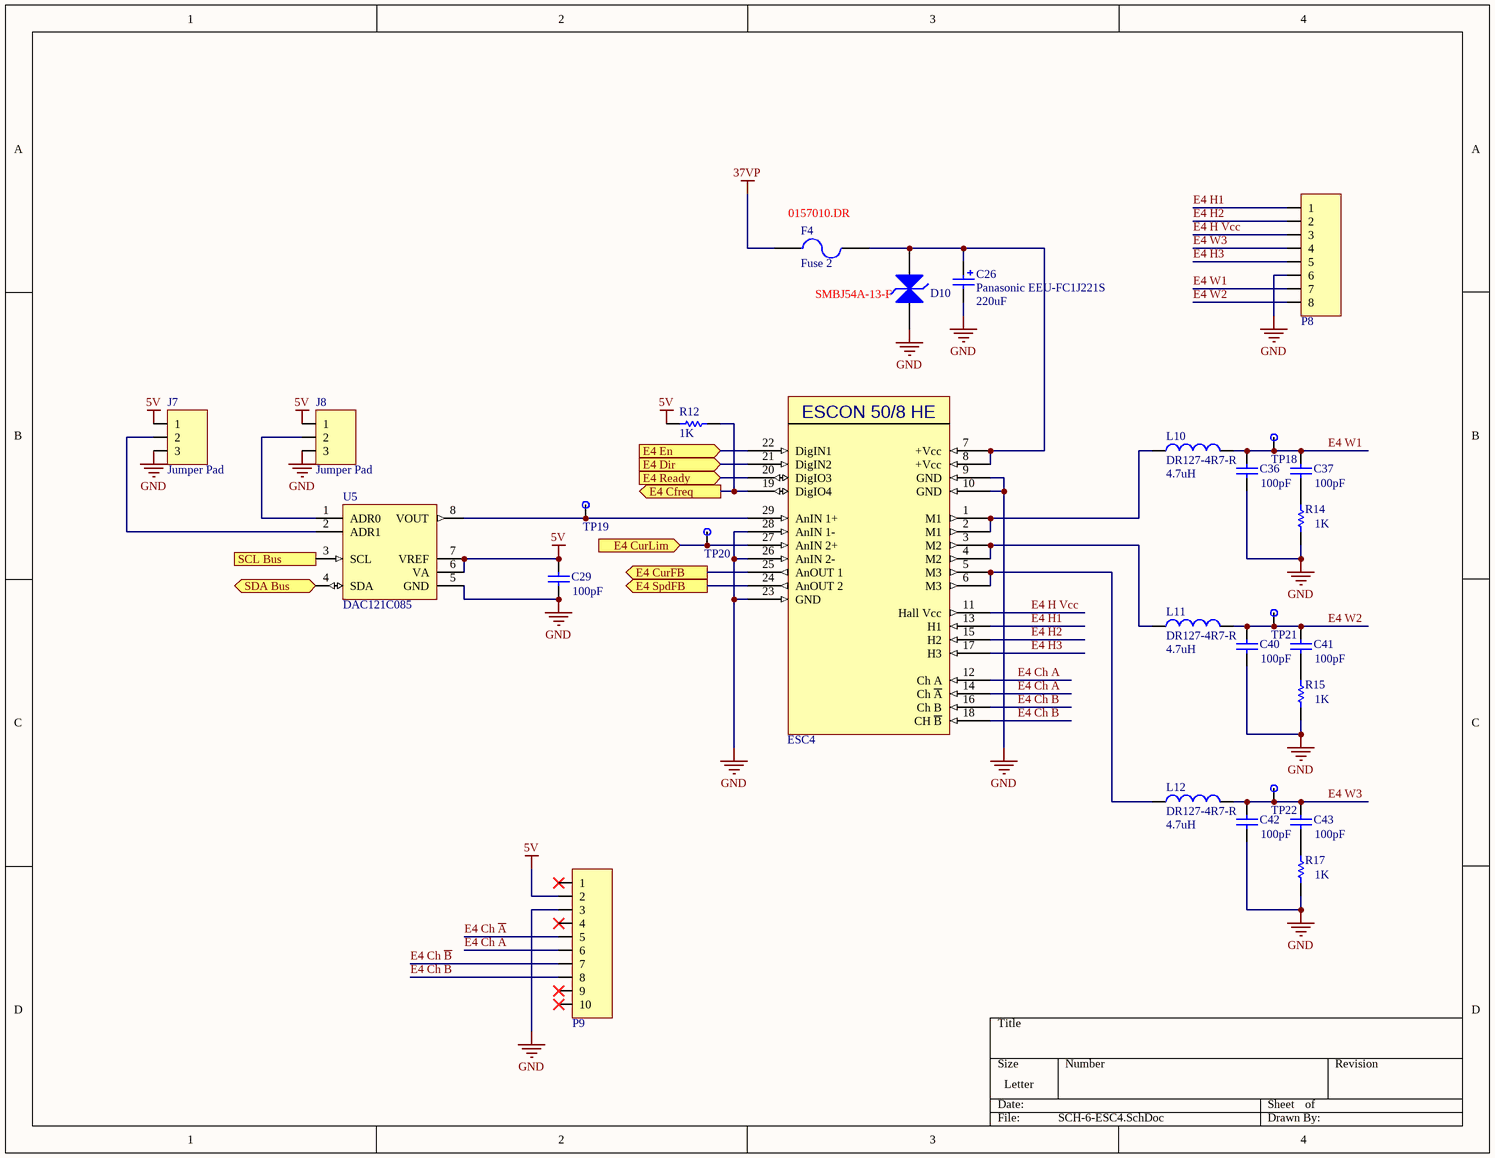
[diagram p5: SCH-6-ESC4.SchDoc]

### Parts
C26  Panasonic EEU-FC1J221S  value 220uF  [Panasonic EEU-FC1J221S]
C29  value 100pF  [C1206]  (hidden comment: Cap Semi)
C36  value 100pF  [C1206]  (hidden comment: Cap Semi)
C37  value 100pF  [C1206]  (hidden comment: Cap Semi)
C40  value 100pF  [C1206]  (hidden comment: Cap Semi)
C41  value 100pF  [C1206]  (hidden comment: Cap Semi)
C42  value 100pF  [C1206]  (hidden comment: Cap Semi)
C43  value 100pF  [C1206]  (hidden comment: Cap Semi)
D10  TVS_DIODE  [SMBJ54A-13-F]  (value not drawn)
ESC4  ESCON 50/8 HE  [ESCON 50/8 HE]  (value not drawn)
F4  Fuse 2  [0157010.DR]
J7  Jumper Pad  [3 Pad TH]
J8  Jumper Pad  [3 Pad TH]
L10  DR127-4R7-R  value 4.7uH  [DR127-4R7-R]
L11  DR127-4R7-R  value 4.7uH  [DR127-4R7-R]
L12  DR127-4R7-R  value 4.7uH  [DR127-4R7-R]
P8  Mini-Fit Jr 8 Pos  [Molex Mini-Fit Jr 0039281083]  (value not drawn)
P9  Header_10_Pos_Ribbon Male  [3M_2510-6002UB]  (value not drawn)
R12  value 1K  [RESC1608X06N_0603]  (hidden comment: Res1)
R14  value 1K  [RESC1608X06N_0603]  (hidden comment: Res1)
R15  value 1K  [RESC1608X06N_0603]  (hidden comment: Res1)
R17  value 1K  [RESC1608X06N_0603]  (hidden comment: Res1)
TP18  TestPt  [50_MIL_PAD]  (value not drawn)
TP19  TestPt  [50_MIL_PAD]  (value not drawn)
TP20  TestPt  [50_MIL_PAD]  (value not drawn)
TP21  TestPt  [50_MIL_PAD]  (value not drawn)
TP22  TestPt  [50_MIL_PAD]  (value not drawn)
U5  DAC121C085  [MUA08A_L]

### Ports
E4 Cfreq (out), E4 CurFB (out), E4 CurLim (in), E4 Dir (in), E4 En (in), E4 Ready (in), E4 SpdFB (out), SCL Bus (in), SDA Bus (bidir)

### Nets
5V: C29.2 J7.1 J8.1 P9.2 R12.2 U5.6(VA) U5.7(VREF)
37VP: F4.1
GND: C26.2 C29.1 C36.1 C40.1 C42.1 D10.1(A) ESC4.9(GND) ESC4.10(GND) ESC4.23(GND) ESC4.26(AnIN_2-) ESC4.28(AnIN_1-) J7.3 J8.3 P8.6 P9.3 R14.1 R15.1 R17.1 U5.5(GND)
E4 Ch A: ESC4.12(Ch_A) P9.6
E4 Ch ~{A}: ESC4.14(Ch_~{A}) P9.5
E4 Ch B: ESC4.16(Ch_B) P9.8
E4 Ch ~{B}: ESC4.18(CH_~{B}) P9.7
E4 H1: ESC4.13(H1) P8.1
E4 H2: ESC4.15(H2) P8.2
E4 H3: ESC4.17(H3) P8.5
E4 H Vcc: ESC4.11(Hall_Vcc) P8.3
E4 W1: C36.2 C37.2 L10.2 P8.7 TP18.1
E4 W2: C40.2 C41.2 L11.2 P8.8 TP21.1
E4 W3: C42.2 C43.2 L12.2 P8.4 TP22.1
NetARD1_4: ESC4.27(AnIN_2+) TP20.1 ; port E4 CurLim
NetARD1_20: U5.4(SDA) ; port SDA Bus
NetARD1_21: U5.3(SCL) ; port SCL Bus
NetARD1_34: ESC4.21(DigIN2) ; port E4 Dir
NetARD1_35: ESC4.22(DigIN1) ; port E4 En
NetARD1_36: ESC4.19(DigIO4) R12.1 ; port E4 Cfreq
NetARD1_37: ESC4.20(DigIO3) ; port E4 Ready
NetARD1_64: ESC4.24(AnOUT_2) ; port E4 SpdFB
NetARD1_65: ESC4.25(AnOUT_1) ; port E4 CurFB
NetC26_1: C26.1 D10.2(K) ESC4.7(+Vcc) ESC4.8(+Vcc) F4.2
NetC37_1: C37.1 R14.2
NetC41_1: C41.1 R15.2
NetC43_1: C43.1 R17.2
NetESC4_1: ESC4.1(M1) ESC4.2(M1) L10.1
NetESC4_3: ESC4.3(M2) ESC4.4(M2) L11.1
NetESC4_5: ESC4.5(M3) ESC4.6(M3) L12.1
NetESC4_29: ESC4.29(AnIN_1+) TP19.1 U5.8(VOUT)
NetJ7_2: J7.2 U5.2(ADR1)
NetJ8_2: J8.2 U5.1(ADR0)

Not connected (* = marked no-connect by the designer): P9 1* 4* 9* 10*

### Notes on the sheet
- (near F4) 0157010.DR
- (near D10) SMBJ54A-13-F

### Library data of the parts
C26 = Panasonic EEU-FC1J221S: Polarized Capacitor (Radial)
C29 C36 C37 C40-C43 = Cap Semi: Capacitor (Semiconductor SIM Model); Published: 8-Jun-2000; LatestRevisionDate: 29-May-2009; LatestRevisionNote: IPC-7351 Footprint Added.; PackageReference: C1206; Publisher: Altium Limited; PackageDescription: Chip Capacitor
D10 = TVS_DIODE: TVS Diode; Published: 8-Jun-2000; LatestRevisionDate: 17-Jul-2002; LatestRevisionNote: Re-released for DXP Platform.; PackageVersion: Sep-1996; PackageReference: SMC; Publisher: Altium Limited; PackageDescription: DO-214-AB/SMC; 2 C-Bend Leads; Body 7.9 x 5.9 mm, inc. leads (LxW); Code_JEDEC: DO-214-AB
ESC4 = ESCON 50/8 HE: ESCON Module 50/8 HE Servocontroller
F4 = Fuse 2: Fuse; Published: 8-Jun-2000; LatestRevisionDate: 17-Jul-2002; LatestRevisionNote: Re-released for DXP Platform.; PackageReference: PIN-W2/E2.8; Publisher: Altium Limited; PackageDescription: Thru-Hole; 2 Leads
J7 J8 = 3 Pad Jump Sel
L10-L12 = DR127-4R7-R: as L1 on sheet SCH-3-ESC1; Published: 8-Jun-2000; LatestRevisionDate: 29-May-2009; LatestRevisionNote: IPC-7351 Footprint Added.; PackageReference: 0402-A; Publisher: Altium Limited; PackageDescription: Chip Inductor; Code_JEITA: 0402
P8 = Molex Mini-Fit Jr 8pos Vert
P9 = Header_10_Pos_Ribbon Male: 3M_2510-6002UB
R12 R14 R15 R17 = Res1: Resistor; Published: 8-Jun-2000; LatestRevisionDate: 17-Jul-2002; LatestRevisionNote: Re-released for DXP Platform.; PackageReference: AXIAL-0.3; Publisher: Altium Limited; PackageDescription: Axial Device, Thru-Hole; 2 Leads; 0.3 in Pin Spacing
U5 = DAC121C085: as U3 on sheet SCH-3-ESC1; ComponentLink3URL: http://www.national.com/packaging/folders/mua08a.html; ComponentLink2URL: http://www.national.com/pf/DA/DAC121C085.html; Code_JEDEC: MO-187-AA; ComponentLink1URL: http://www.national.com/ds/DA/DAC121C085.pdf; RoHS: Y; PackageVersion: revF, Apr-2008; PackageDescription: MINI SOIC, .118 x .118 x .034in, 8 Lead, .0256in Pitch; PackageReference: MUA08A; PinCount: 8; DatasheetVersion: Mar-2008; ComponentLink1Description: DAC121C085 Datasheet; ComponentLink2Description: DAC121C085 Web Page; ComponentLink3Description: MUA08A Package Page; RevisionNote: Component URLs added

## Sheet SCH-7-ESC5.SchDoc
size Letter
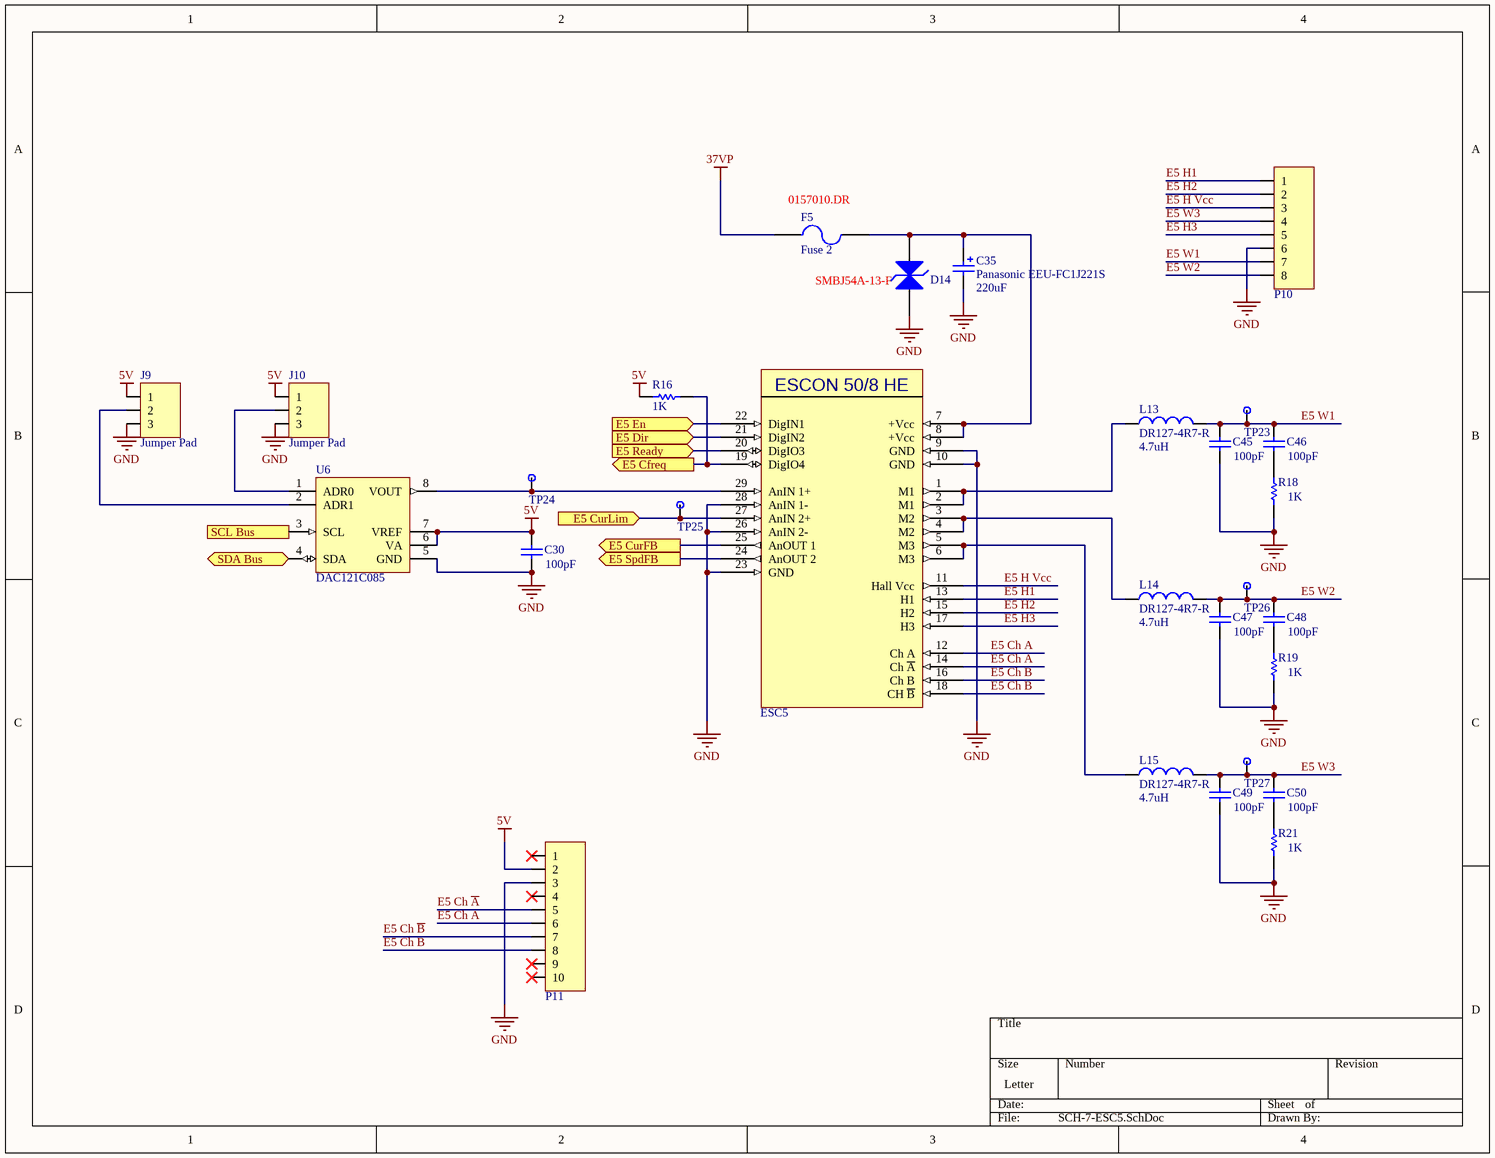
[diagram p6: SCH-7-ESC5.SchDoc]

### Parts
C30  value 100pF  [C1206]  (hidden comment: Cap Semi)
C35  Panasonic EEU-FC1J221S  value 220uF  [Panasonic EEU-FC1J221S]
C45  value 100pF  [C1206]  (hidden comment: Cap Semi)
C46  value 100pF  [C1206]  (hidden comment: Cap Semi)
C47  value 100pF  [C1206]  (hidden comment: Cap Semi)
C48  value 100pF  [C1206]  (hidden comment: Cap Semi)
C49  value 100pF  [C1206]  (hidden comment: Cap Semi)
C50  value 100pF  [C1206]  (hidden comment: Cap Semi)
D14  TVS_DIODE  [SMBJ54A-13-F]  (value not drawn)
ESC5  ESCON 50/8 HE  [ESCON 50/8 HE]  (value not drawn)
F5  Fuse 2  [0157010.DR]
J9  Jumper Pad  [3 Pad TH]
J10  Jumper Pad  [3 Pad TH]
L13  DR127-4R7-R  value 4.7uH  [DR127-4R7-R]
L14  DR127-4R7-R  value 4.7uH  [DR127-4R7-R]
L15  DR127-4R7-R  value 4.7uH  [DR127-4R7-R]
P10  Mini-Fit Jr 8 Pos  [Molex Mini-Fit Jr 0039281083]  (value not drawn)
P11  Header_10_Pos_Ribbon Male  [3M_2510-6002UB]  (value not drawn)
R16  value 1K  [RESC1608X06N_0603]  (hidden comment: Res1)
R18  value 1K  [RESC1608X06N_0603]  (hidden comment: Res1)
R19  value 1K  [RESC1608X06N_0603]  (hidden comment: Res1)
R21  value 1K  [RESC1608X06N_0603]  (hidden comment: Res1)
TP23  TestPt  [50_MIL_PAD]  (value not drawn)
TP24  TestPt  [50_MIL_PAD]  (value not drawn)
TP25  TestPt  [50_MIL_PAD]  (value not drawn)
TP26  TestPt  [50_MIL_PAD]  (value not drawn)
TP27  TestPt  [50_MIL_PAD]  (value not drawn)
U6  DAC121C085  [MUA08A_L]

### Ports
E5 Cfreq (out), E5 CurFB (out), E5 CurLim (in), E5 Dir (in), E5 En (in), E5 Ready (in), E5 SpdFB (out), SCL Bus (in), SDA Bus (bidir)

### Nets
5V: C30.2 J9.1 J10.1 P11.2 R16.2 U6.6(VA) U6.7(VREF)
37VP: F5.1
GND: C30.1 C35.2 C45.1 C47.1 C49.1 D14.1(A) ESC5.9(GND) ESC5.10(GND) ESC5.23(GND) ESC5.26(AnIN_2-) ESC5.28(AnIN_1-) J9.3 J10.3 P10.6 P11.3 R18.1 R19.1 R21.1 U6.5(GND)
E5 Ch A: ESC5.12(Ch_A) P11.6
E5 Ch ~{A}: ESC5.14(Ch_~{A}) P11.5
E5 Ch B: ESC5.16(Ch_B) P11.8
E5 Ch ~{B}: ESC5.18(CH_~{B}) P11.7
E5 H1: ESC5.13(H1) P10.1
E5 H2: ESC5.15(H2) P10.2
E5 H3: ESC5.17(H3) P10.5
E5 H Vcc: ESC5.11(Hall_Vcc) P10.3
E5 W1: C45.2 C46.2 L13.2 P10.7 TP23.1
E5 W2: C47.2 C48.2 L14.2 P10.8 TP26.1
E5 W3: C49.2 C50.2 L15.2 P10.4 TP27.1
NetARD1_5: ESC5.27(AnIN_2+) TP25.1 ; port E5 CurLim
NetARD1_20: U6.4(SDA) ; port SDA Bus
NetARD1_21: U6.3(SCL) ; port SCL Bus
NetARD1_38: ESC5.21(DigIN2) ; port E5 Dir
NetARD1_39: ESC5.22(DigIN1) ; port E5 En
NetARD1_40: ESC5.19(DigIO4) R16.1 ; port E5 Cfreq
NetARD1_41: ESC5.20(DigIO3) ; port E5 Ready
NetARD1_62: ESC5.24(AnOUT_2) ; port E5 SpdFB
NetARD1_63: ESC5.25(AnOUT_1) ; port E5 CurFB
NetC35_1: C35.1 D14.2(K) ESC5.7(+Vcc) ESC5.8(+Vcc) F5.2
NetC46_1: C46.1 R18.2
NetC48_1: C48.1 R19.2
NetC50_1: C50.1 R21.2
NetESC5_1: ESC5.1(M1) ESC5.2(M1) L13.1
NetESC5_3: ESC5.3(M2) ESC5.4(M2) L14.1
NetESC5_5: ESC5.5(M3) ESC5.6(M3) L15.1
NetESC5_29: ESC5.29(AnIN_1+) TP24.1 U6.8(VOUT)
NetJ9_2: J9.2 U6.2(ADR1)
NetJ10_2: J10.2 U6.1(ADR0)

Not connected (* = marked no-connect by the designer): P11 1* 4* 9* 10*

### Notes on the sheet
- (near F5) 0157010.DR
- (near D14) SMBJ54A-13-F

### Library data of the parts
C30 C45-C50 = Cap Semi: Capacitor (Semiconductor SIM Model); Published: 8-Jun-2000; LatestRevisionDate: 29-May-2009; LatestRevisionNote: IPC-7351 Footprint Added.; PackageReference: C1206; Publisher: Altium Limited; PackageDescription: Chip Capacitor
C35 = Panasonic EEU-FC1J221S: Polarized Capacitor (Radial)
D14 = TVS_DIODE: TVS Diode; Published: 8-Jun-2000; LatestRevisionDate: 17-Jul-2002; LatestRevisionNote: Re-released for DXP Platform.; PackageVersion: Sep-1996; PackageReference: SMC; Publisher: Altium Limited; PackageDescription: DO-214-AB/SMC; 2 C-Bend Leads; Body 7.9 x 5.9 mm, inc. leads (LxW); Code_JEDEC: DO-214-AB
ESC5 = ESCON 50/8 HE: ESCON Module 50/8 HE Servocontroller
F5 = Fuse 2: Fuse; Published: 8-Jun-2000; LatestRevisionDate: 17-Jul-2002; LatestRevisionNote: Re-released for DXP Platform.; PackageReference: PIN-W2/E2.8; Publisher: Altium Limited; PackageDescription: Thru-Hole; 2 Leads
J9 J10 = 3 Pad Jump Sel
L13-L15 = DR127-4R7-R: as L1 on sheet SCH-3-ESC1; Published: 8-Jun-2000; LatestRevisionDate: 29-May-2009; LatestRevisionNote: IPC-7351 Footprint Added.; PackageReference: 0402-A; Publisher: Altium Limited; PackageDescription: Chip Inductor; Code_JEITA: 0402
P10 = Molex Mini-Fit Jr 8pos Vert
P11 = Header_10_Pos_Ribbon Male: 3M_2510-6002UB
R16 R18 R19 R21 = Res1: Resistor; Published: 8-Jun-2000; LatestRevisionDate: 17-Jul-2002; LatestRevisionNote: Re-released for DXP Platform.; PackageReference: AXIAL-0.3; Publisher: Altium Limited; PackageDescription: Axial Device, Thru-Hole; 2 Leads; 0.3 in Pin Spacing
U6 = DAC121C085: as U3 on sheet SCH-3-ESC1; ComponentLink3URL: http://www.national.com/packaging/folders/mua08a.html; ComponentLink2URL: http://www.national.com/pf/DA/DAC121C085.html; Code_JEDEC: MO-187-AA; ComponentLink1URL: http://www.national.com/ds/DA/DAC121C085.pdf; RoHS: Y; PackageVersion: revF, Apr-2008; PackageDescription: MINI SOIC, .118 x .118 x .034in, 8 Lead, .0256in Pitch; PackageReference: MUA08A; PinCount: 8; DatasheetVersion: Mar-2008; ComponentLink1Description: DAC121C085 Datasheet; ComponentLink2Description: DAC121C085 Web Page; ComponentLink3Description: MUA08A Package Page; RevisionNote: Component URLs added

## Sheet SCH-8-ESC6.SchDoc
size Letter
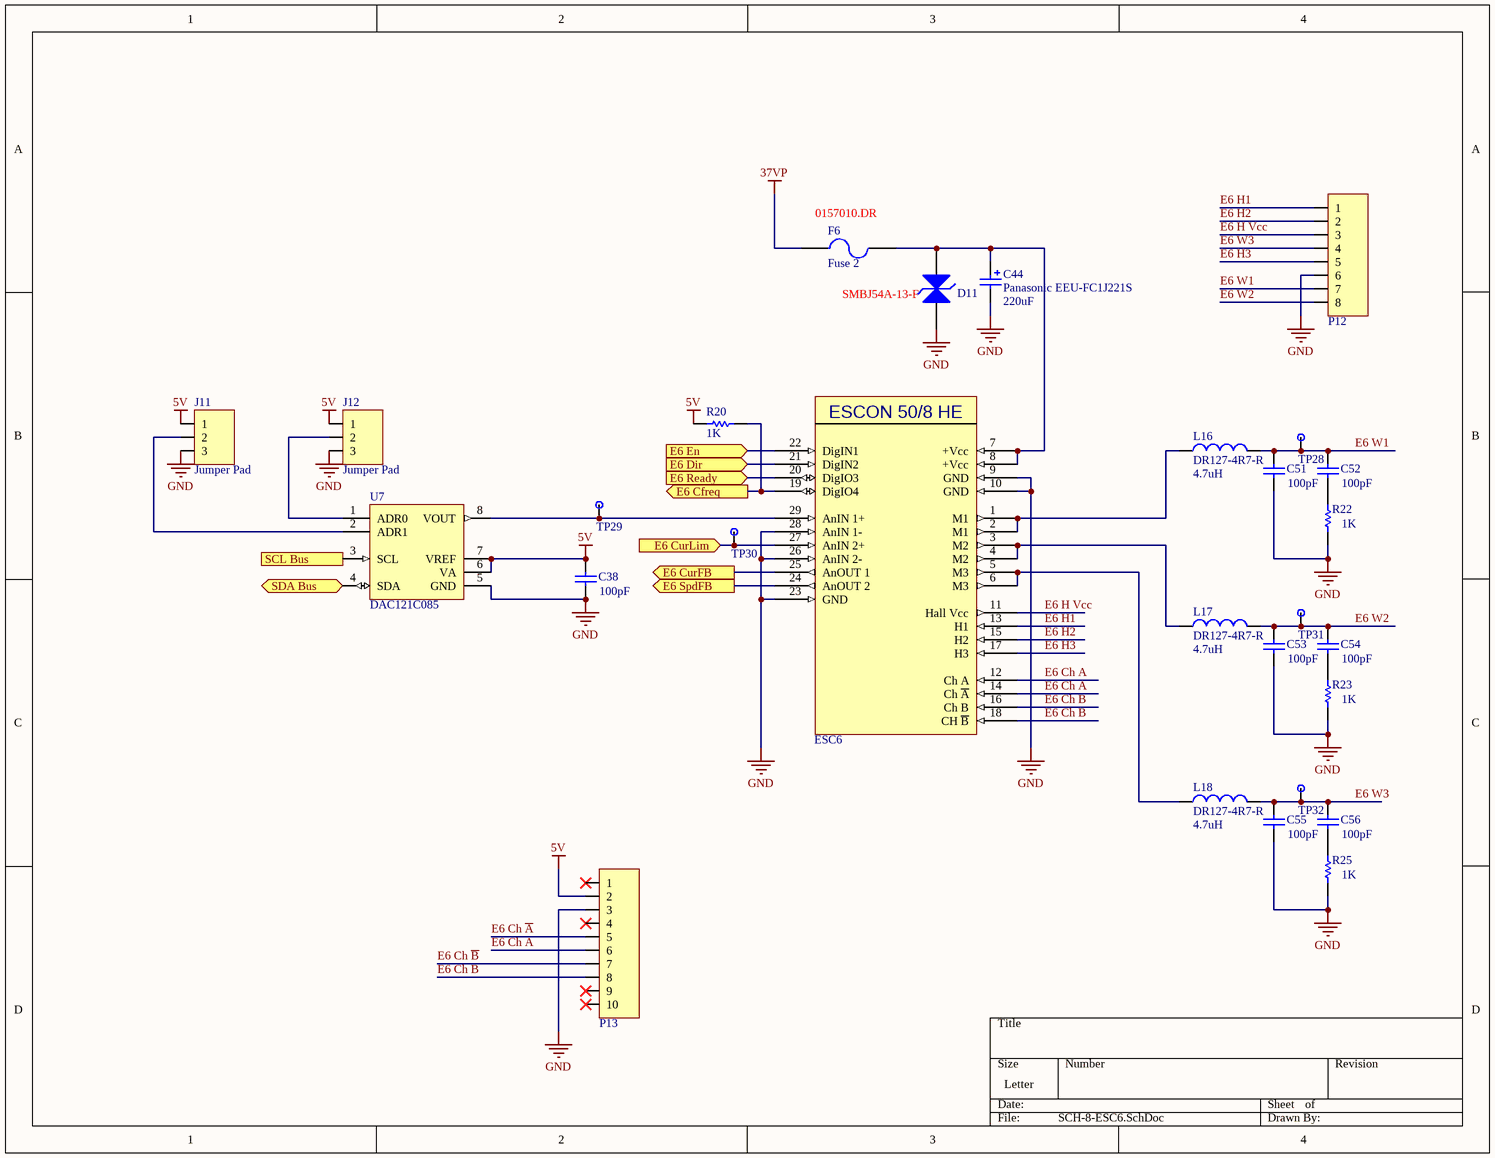
[diagram p7: SCH-8-ESC6.SchDoc]

### Parts
C38  value 100pF  [C1206]  (hidden comment: Cap Semi)
C44  Panasonic EEU-FC1J221S  value 220uF  [Panasonic EEU-FC1J221S]
C51  value 100pF  [C1206]  (hidden comment: Cap Semi)
C52  value 100pF  [C1206]  (hidden comment: Cap Semi)
C53  value 100pF  [C1206]  (hidden comment: Cap Semi)
C54  value 100pF  [C1206]  (hidden comment: Cap Semi)
C55  value 100pF  [C1206]  (hidden comment: Cap Semi)
C56  value 100pF  [C1206]  (hidden comment: Cap Semi)
D11  TVS_DIODE  [SMBJ54A-13-F]  (value not drawn)
ESC6  ESCON 50/8 HE  [ESCON 50/8 HE]  (value not drawn)
F6  Fuse 2  [0157010.DR]
J11  Jumper Pad  [3 Pad TH]
J12  Jumper Pad  [3 Pad TH]
L16  DR127-4R7-R  value 4.7uH  [DR127-4R7-R]
L17  DR127-4R7-R  value 4.7uH  [DR127-4R7-R]
L18  DR127-4R7-R  value 4.7uH  [DR127-4R7-R]
P12  Mini-Fit Jr 8 Pos  [Molex Mini-Fit Jr 0039281083]  (value not drawn)
P13  Header_10_Pos_Ribbon Male  [3M_2510-6002UB]  (value not drawn)
R20  value 1K  [RESC1608X06N_0603]  (hidden comment: Res1)
R22  value 1K  [RESC1608X06N_0603]  (hidden comment: Res1)
R23  value 1K  [RESC1608X06N_0603]  (hidden comment: Res1)
R25  value 1K  [RESC1608X06N_0603]  (hidden comment: Res1)
TP28  TestPt  [50_MIL_PAD]  (value not drawn)
TP29  TestPt  [50_MIL_PAD]  (value not drawn)
TP30  TestPt  [50_MIL_PAD]  (value not drawn)
TP31  TestPt  [50_MIL_PAD]  (value not drawn)
TP32  TestPt  [50_MIL_PAD]  (value not drawn)
U7  DAC121C085  [MUA08A_L]

### Ports
E6 Cfreq (out), E6 CurFB (out), E6 CurLim (in), E6 Dir (in), E6 En (in), E6 Ready (in), E6 SpdFB (out), SCL Bus (in), SDA Bus (bidir)

### Nets
5V: C38.2 J11.1 J12.1 P13.2 R20.2 U7.6(VA) U7.7(VREF)
37VP: F6.1
GND: C38.1 C44.2 C51.1 C53.1 C55.1 D11.1(A) ESC6.9(GND) ESC6.10(GND) ESC6.23(GND) ESC6.26(AnIN_2-) ESC6.28(AnIN_1-) J11.3 J12.3 P12.6 P13.3 R22.1 R23.1 R25.1 U7.5(GND)
E6 Ch A: ESC6.12(Ch_A) P13.6
E6 Ch ~{A}: ESC6.14(Ch_~{A}) P13.5
E6 Ch B: ESC6.16(Ch_B) P13.8
E6 Ch ~{B}: ESC6.18(CH_~{B}) P13.7
E6 H1: ESC6.13(H1) P12.1
E6 H2: ESC6.15(H2) P12.2
E6 H3: ESC6.17(H3) P12.5
E6 H Vcc: ESC6.11(Hall_Vcc) P12.3
E6 W1: C51.2 C52.2 L16.2 P12.7 TP28.1
E6 W2: C53.2 C54.2 L17.2 P12.8 TP31.1
E6 W3: C55.2 C56.2 L18.2 P12.4 TP32.1
NetARD1_6: ESC6.27(AnIN_2+) TP30.1 ; port E6 CurLim
NetARD1_20: U7.4(SDA) ; port SDA Bus
NetARD1_21: U7.3(SCL) ; port SCL Bus
NetARD1_42: ESC6.19(DigIO4) R20.1 ; port E6 Cfreq
NetARD1_43: ESC6.20(DigIO3) ; port E6 Ready
NetARD1_44: ESC6.21(DigIN2) ; port E6 Dir
NetARD1_45: ESC6.22(DigIN1) ; port E6 En
NetARD1_60: ESC6.24(AnOUT_2) ; port E6 SpdFB
NetARD1_61: ESC6.25(AnOUT_1) ; port E6 CurFB
NetC44_1: C44.1 D11.2(K) ESC6.7(+Vcc) ESC6.8(+Vcc) F6.2
NetC52_1: C52.1 R22.2
NetC54_1: C54.1 R23.2
NetC56_1: C56.1 R25.2
NetESC6_1: ESC6.1(M1) ESC6.2(M1) L16.1
NetESC6_3: ESC6.3(M2) ESC6.4(M2) L17.1
NetESC6_5: ESC6.5(M3) ESC6.6(M3) L18.1
NetESC6_29: ESC6.29(AnIN_1+) TP29.1 U7.8(VOUT)
NetJ11_2: J11.2 U7.2(ADR1)
NetJ12_2: J12.2 U7.1(ADR0)

Not connected (* = marked no-connect by the designer): P13 1* 4* 9* 10*

### Notes on the sheet
- (near F6) 0157010.DR
- (near D11) SMBJ54A-13-F

### Library data of the parts
C38 C51-C56 = Cap Semi: Capacitor (Semiconductor SIM Model); Published: 8-Jun-2000; LatestRevisionDate: 29-May-2009; LatestRevisionNote: IPC-7351 Footprint Added.; PackageReference: C1206; Publisher: Altium Limited; PackageDescription: Chip Capacitor
C44 = Panasonic EEU-FC1J221S: Polarized Capacitor (Radial)
D11 = TVS_DIODE: TVS Diode; Published: 8-Jun-2000; LatestRevisionDate: 17-Jul-2002; LatestRevisionNote: Re-released for DXP Platform.; PackageVersion: Sep-1996; PackageReference: SMC; Publisher: Altium Limited; PackageDescription: DO-214-AB/SMC; 2 C-Bend Leads; Body 7.9 x 5.9 mm, inc. leads (LxW); Code_JEDEC: DO-214-AB
ESC6 = ESCON 50/8 HE: ESCON Module 50/8 HE Servocontroller
F6 = Fuse 2: Fuse; Published: 8-Jun-2000; LatestRevisionDate: 17-Jul-2002; LatestRevisionNote: Re-released for DXP Platform.; PackageReference: PIN-W2/E2.8; Publisher: Altium Limited; PackageDescription: Thru-Hole; 2 Leads
J11 J12 = 3 Pad Jump Sel
L16-L18 = DR127-4R7-R: as L1 on sheet SCH-3-ESC1; Published: 8-Jun-2000; LatestRevisionDate: 29-May-2009; LatestRevisionNote: IPC-7351 Footprint Added.; PackageReference: 0402-A; Publisher: Altium Limited; PackageDescription: Chip Inductor; Code_JEITA: 0402
P12 = Molex Mini-Fit Jr 8pos Vert
P13 = Header_10_Pos_Ribbon Male: 3M_2510-6002UB
R20 R22 R23 R25 = Res1: Resistor; Published: 8-Jun-2000; LatestRevisionDate: 17-Jul-2002; LatestRevisionNote: Re-released for DXP Platform.; PackageReference: AXIAL-0.3; Publisher: Altium Limited; PackageDescription: Axial Device, Thru-Hole; 2 Leads; 0.3 in Pin Spacing
U7 = DAC121C085: as U3 on sheet SCH-3-ESC1; ComponentLink3URL: http://www.national.com/packaging/folders/mua08a.html; ComponentLink2URL: http://www.national.com/pf/DA/DAC121C085.html; Code_JEDEC: MO-187-AA; ComponentLink1URL: http://www.national.com/ds/DA/DAC121C085.pdf; RoHS: Y; PackageVersion: revF, Apr-2008; PackageDescription: MINI SOIC, .118 x .118 x .034in, 8 Lead, .0256in Pitch; PackageReference: MUA08A; PinCount: 8; DatasheetVersion: Mar-2008; ComponentLink1Description: DAC121C085 Datasheet; ComponentLink2Description: DAC121C085 Web Page; ComponentLink3Description: MUA08A Package Page; RevisionNote: Component URLs added

## Sheet SCH-9-Battery Voltage Indicators.SchDoc
size B
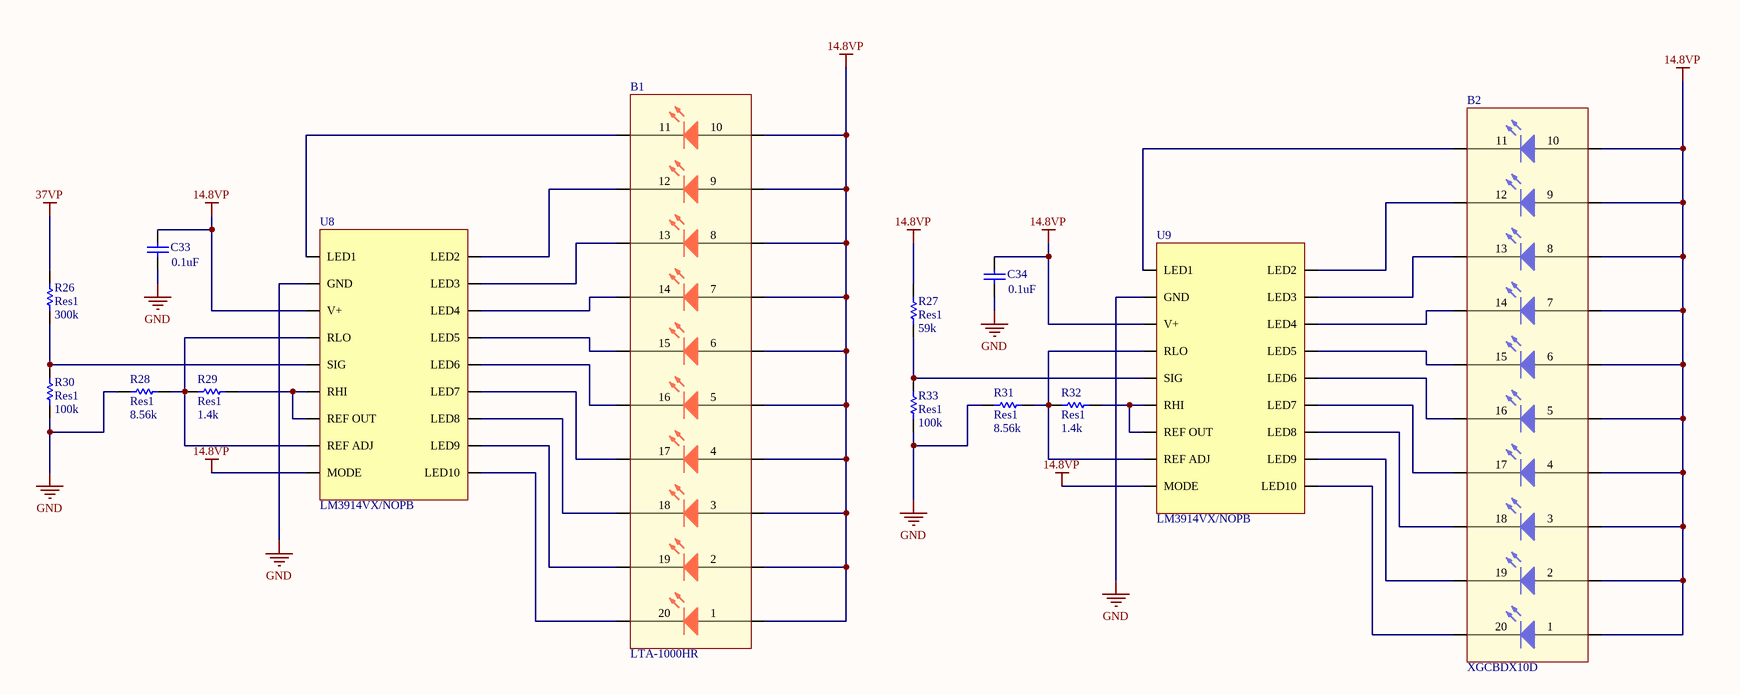
[diagram p8: SCH-9-Battery Voltage Indicators.SchDoc]

### Parts
B1  LTA-1000HR  [LED BAR 10pos]
B2  XGCBDX10D  [LED BAR 10pos]
C33  value 0.1uF  [C1206]  (hidden comment: Cap Semi)
C34  value 0.1uF  [C1206]  (hidden comment: Cap Semi)
R26  Res1  value 300k  [RESC1608X06N_0603]
R27  Res1  value 59k  [RESC1608X06N_0603]
R28  Res1  value 8.56k  [RESC1608X06N_0603]
R29  Res1  value 1.4k  [RESC1608X06N_0603]
R30  Res1  value 100k  [RESC1608X06N_0603]
R31  Res1  value 8.56k  [RESC1608X06N_0603]
R32  Res1  value 1.4k  [RESC1608X06N_0603]
R33  Res1  value 100k  [RESC1608X06N_0603]
U8  LM3914VX/NOPB  [PLCC127P990X990X457-20N]
U9  LM3914VX/NOPB  [PLCC127P990X990X457-20N]

### Nets
14.8VP: B1.1(A) B1.2(A) B1.3(A) B1.4(A) B1.5(A) B1.6(A) B1.7(A) B1.8(A) B1.9(A) B1.10(A) B2.1(A) B2.2(A) B2.3(A) B2.4(A) B2.5(A) B2.6(A) B2.7(A) B2.8(A) B2.9(A) B2.10(A) C33.2 C34.2 R27.2 U8.3(V+) U8.11(MODE) U9.3(V+) U9.11(MODE)
37VP: R26.2
GND: C33.1 C34.1 R28.1 R30.1 R31.1 R33.1 U8.2(GND) U9.2(GND)
NetB1_11: B1.11(K) U8.1(LED1)
NetB1_12: B1.12(K) U8.20(LED2)
NetB1_13: B1.13(K) U8.19(LED3)
NetB1_14: B1.14(K) U8.18(LED4)
NetB1_15: B1.15(K) U8.17(LED5)
NetB1_16: B1.16(K) U8.16(LED6)
NetB1_17: B1.17(K) U8.15(LED7)
NetB1_18: B1.18(K) U8.14(LED8)
NetB1_19: B1.19(K) U8.13(LED9)
NetB1_20: B1.20(K) U8.12(LED10)
NetB2_11: B2.11(K) U9.1(LED1)
NetB2_12: B2.12(K) U9.20(LED2)
NetB2_13: B2.13(K) U9.19(LED3)
NetB2_14: B2.14(K) U9.18(LED4)
NetB2_15: B2.15(K) U9.17(LED5)
NetB2_16: B2.16(K) U9.16(LED6)
NetB2_17: B2.17(K) U9.15(LED7)
NetB2_18: B2.18(K) U9.14(LED8)
NetB2_19: B2.19(K) U9.13(LED9)
NetB2_20: B2.20(K) U9.12(LED10)
NetR26_1: R26.1 R30.2 U8.5(SIG)
NetR27_1: R27.1 R33.2 U9.5(SIG)
NetR28_2: R28.2 R29.1 U8.4(RLO) U8.10(REF_ADJ)
NetR29_2: R29.2 U8.6(RHI) U8.8(REF_OUT)
NetR31_2: R31.2 R32.1 U9.4(RLO) U9.10(REF_ADJ)
NetR32_2: R32.2 U9.6(RHI) U9.8(REF_OUT)

### Library data of the parts
B1 = LED BAR 10 RED
B2 = LED BAR 10 BLUE
C33 C34 = Cap Semi: Capacitor (Semiconductor SIM Model); Published: 8-Jun-2000; LatestRevisionDate: 29-May-2009; LatestRevisionNote: IPC-7351 Footprint Added.; PackageReference: C1206; Publisher: Altium Limited; PackageDescription: Chip Capacitor
R26-R33 = Res1: Resistor; Published: 8-Jun-2000; LatestRevisionDate: 17-Jul-2002; LatestRevisionNote: Re-released for DXP Platform.; PackageReference: AXIAL-0.3; Publisher: Altium Limited; PackageDescription: Axial Device, Thru-Hole; 2 Leads; 0.3 in Pin Spacing
U8 U9 = LM3914

## Sheet SCH-10-Power Connectors.SchDoc
size A
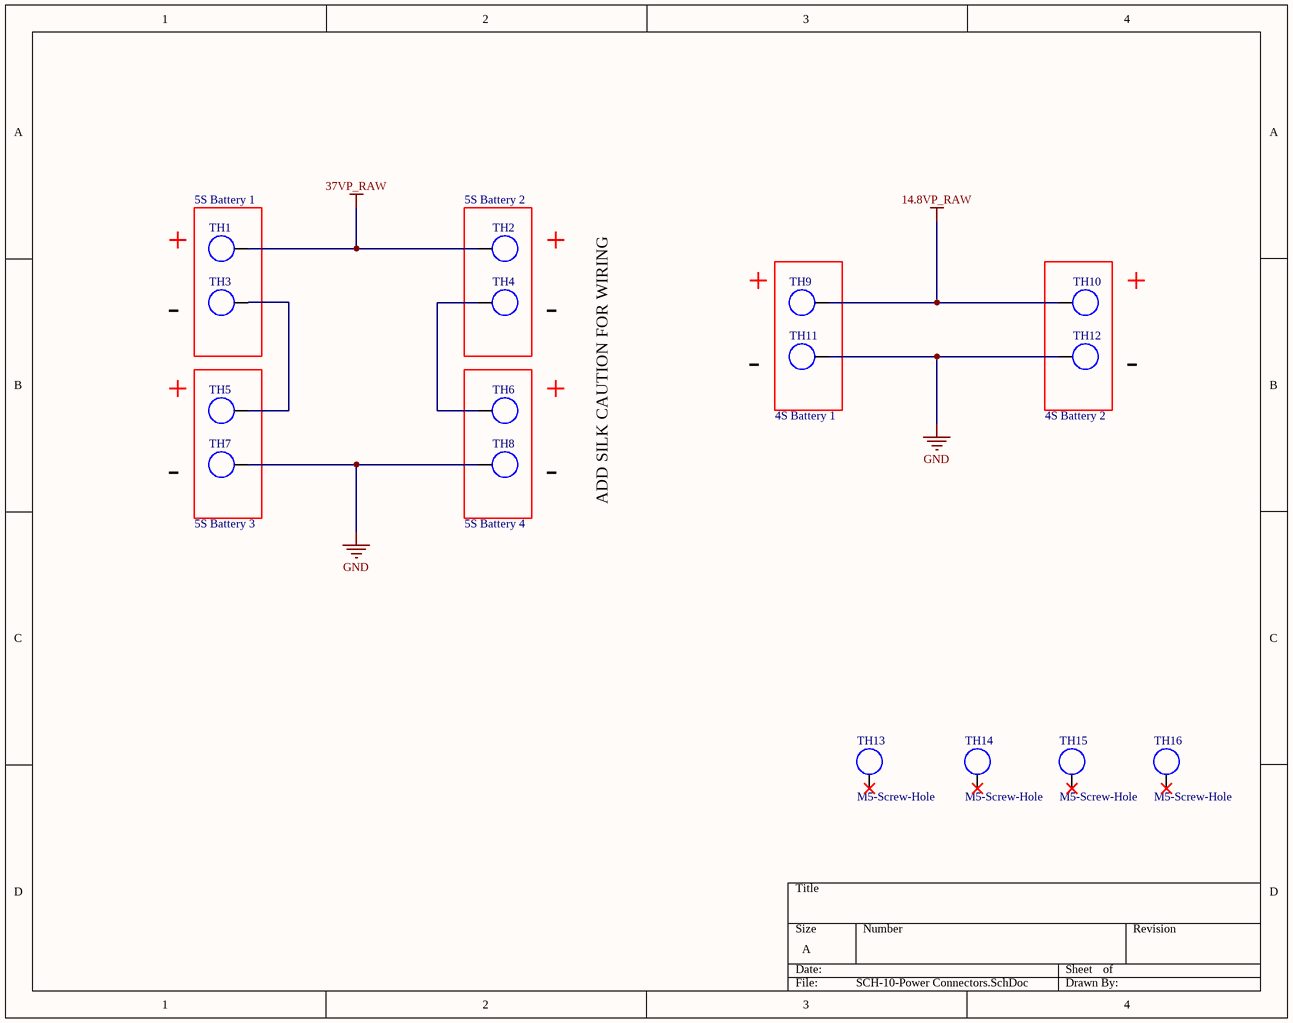
[diagram p9: SCH-10-Power Connectors.SchDoc]

### Parts
TH1  12AWG_TH  [12AWG_Wire_TH]  (value not drawn)
TH2  12AWG_TH  [12AWG_Wire_TH]  (value not drawn)
TH3  12AWG_TH  [12AWG_Wire_TH]  (value not drawn)
TH4  12AWG_TH  [12AWG_Wire_TH]  (value not drawn)
TH5  12AWG_TH  [12AWG_Wire_TH]  (value not drawn)
TH6  12AWG_TH  [12AWG_Wire_TH]  (value not drawn)
TH7  12AWG_TH  [12AWG_Wire_TH]  (value not drawn)
TH8  12AWG_TH  [12AWG_Wire_TH]  (value not drawn)
TH9  10AWG_TH  [10AWG_Wire_TH]  (value not drawn)
TH10  10AWG_TH  [10AWG_Wire_TH]  (value not drawn)
TH11  10AWG_TH  [10AWG_Wire_TH]  (value not drawn)
TH12  10AWG_TH  [10AWG_Wire_TH]  (value not drawn)
TH13  M5-Screw-Hole  [M5_Screw_Hole]
TH14  M5-Screw-Hole  [M5_Screw_Hole]
TH15  M5-Screw-Hole  [M5_Screw_Hole]
TH16  M5-Screw-Hole  [M5_Screw_Hole]

### Blocks framed on the sheet
5S Battery 1: TH1 TH3
5S Battery 2: TH2 TH4

### Nets
14.8VP_RAW: TH9.1 TH10.1
37VP_RAW: TH1.1 TH2.1
GND: TH7.1 TH8.1 TH11.1 TH12.1
NetTH3_1: TH3.1 TH5.1
NetTH4_1: TH4.1 TH6.1

Not connected (* = marked no-connect by the designer): TH13 1*; TH14 1*; TH15 1*; TH16 1*

### Notes on the sheet
- +
- -
- (near TH11) 4S Battery 1
- (near TH12) 4S Battery 2
- ADD SILK CAUTION FOR WIRING
- (near TH7) 5S Battery 3
- (near TH8) 5S Battery 4

## Sheet SCH-11-Out Going Connectors.SchDoc
size A
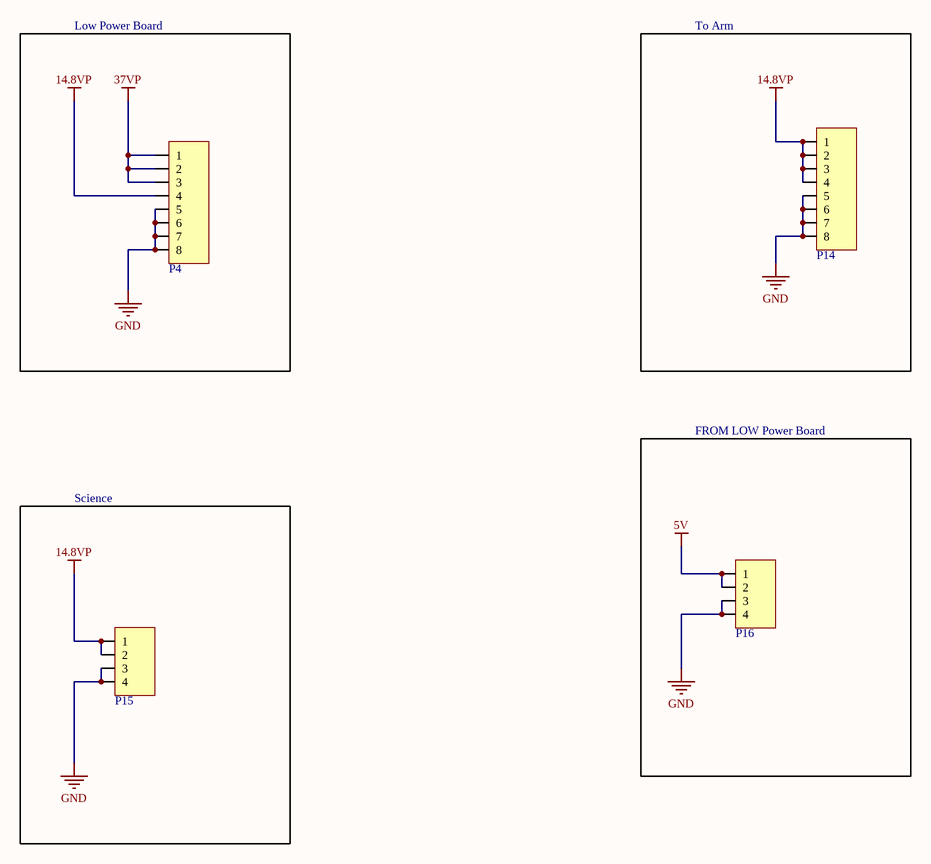
[diagram p10: SCH-11-Out Going Connectors.SchDoc]

### Parts
P4  Mini-Fit Jr 8 Pos  [Molex Mini-Fit Jr 0039281083]  (value not drawn)
P14  Mini-Fit Jr 8 Pos RA  [MOLEX 172065-0208]  (value not drawn)
P15  Mini-Fit Jr 4 Pos  [MOLEX 0039281043]  (value not drawn)
P16  Mini-Fit Jr 4 Pos  [MOLEX 0039281043]  (value not drawn)

### Blocks framed on the sheet
Low Power Board: P4
To Arm: P14
FROM LOW Power Board: P16
Science: P15

### Nets
5V: P16.1 P16.2
14.8VP: P4.4 P14.1 P14.2 P14.3 P14.4 P15.1 P15.2
37VP: P4.1 P4.2 P4.3
GND: P4.5 P4.6 P4.7 P4.8 P14.5 P14.6 P14.7 P14.8 P15.3 P15.4 P16.3 P16.4

### Library data of the parts
P4 = Molex Mini-Fit Jr 8pos Vert
P14 = Molex Mega-Fit 8pos Vert
P15 P16 = Molex 0039281043: Mini-Fit Jr. Header, Dual Row, Right-Angle, with Snap-in Plastic Peg PCB Lock, 6 Circuits, PA Polyamide Nylon 6/6 94V-2, 0.76µm Select Gold (Au) Plating